# EAGLE design BatchC (EAGLE 6.4)

## Sheet 1 of 5
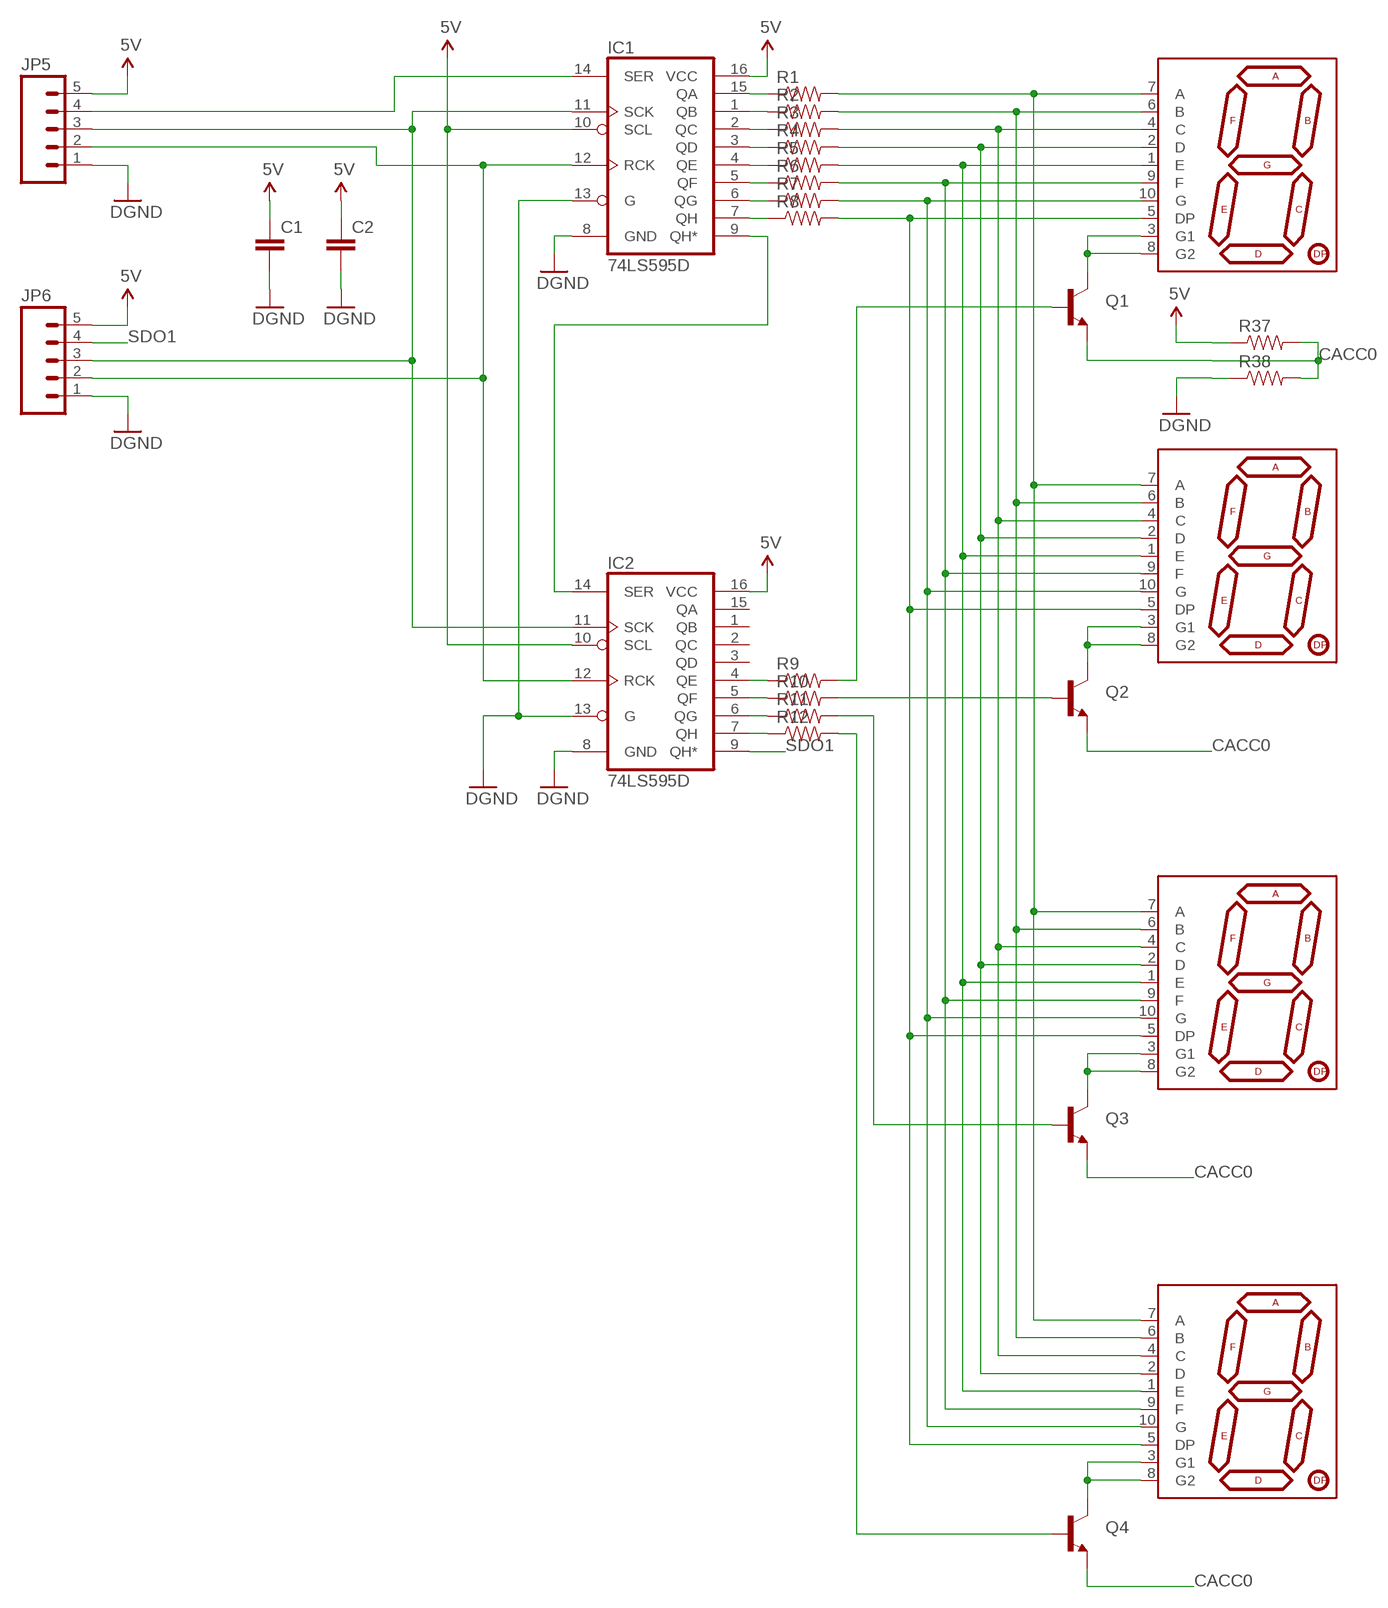
[diagram p0: schematic, sheet 1]

### Parts
C1  CAP1206  [1206]
C2  CAP1206  [1206]
IC1  74LS595D  [SO16]
IC2  74LS595D  [SO16]
JP5  M05PTH  [1X05]
JP6  M05PTH  [1X05]
Q1  TRANSISTOR_NPNSOT23  [SOT23]
Q2  TRANSISTOR_NPNSOT23  [SOT23]
Q3  TRANSISTOR_NPNSOT23  [SOT23]
Q4  TRANSISTOR_NPNSOT23  [SOT23]
R1  RESISTOR0805-RES  [0805]
R2  RESISTOR0805-RES  [0805]
R3  RESISTOR0805-RES  [0805]
R4  RESISTOR0805-RES  [0805]
R5  RESISTOR0805-RES  [0805]
R6  RESISTOR0805-RES  [0805]
R7  RESISTOR0805-RES  [0805]
R8  RESISTOR0805-RES  [0805]
R9  RESISTOR0805-RES  [0805]
R10  RESISTOR0805-RES  [0805]
R11  RESISTOR0805-RES  [0805]
R12  RESISTOR0805-RES  [0805]
R37  RESISTOR0805-RES  [0805]
R38  RESISTOR0805-RES  [0805]
U$1  7-SEGMENT-DISPLAYPTH  [7-SEGMENT-DISPLAY]
U$2  7-SEGMENT-DISPLAYPTH  [7-SEGMENT-DISPLAY]
U$3  7-SEGMENT-DISPLAYPTH  [7-SEGMENT-DISPLAY]
U$4  7-SEGMENT-DISPLAYPTH  [7-SEGMENT-DISPLAY]

### Nets
5V: C1.1 C2.1 IC1.10(SCL) IC1.16(VCC) IC2.10(SCL) IC2.16(VCC) JP5.5 JP6.5 R37.1 ; also sheet 2,3
CACC0: Q1.2(E) Q2.2(E) Q3.2(E) Q4.2(E) R37.2 R38.2
GND: C1.2 C2.2 IC1.8(GND) IC1.13(G) IC2.8(GND) IC2.13(G) JP5.1 JP6.1 R38.1 ; supply symbol labelled DGND ; also sheet 2,3,4
N$1: Q2.3(C) U$1.3(G1) U$1.8(G2)
N$2: Q3.3(C) U$2.3(G1) U$2.8(G2)
N$3: Q4.3(C) U$4.3(G1) U$4.8(G2)
N$4: R4.2 U$1.2(D) U$2.2(D) U$3.2(D) U$4.2(D)
N$5: R5.2 U$1.1(E) U$2.1(E) U$3.1(E) U$4.1(E)
N$6: R6.2 U$1.9(F) U$2.9(F) U$3.9(F) U$4.9(F)
N$7: R7.2 U$1.10(G) U$2.10(G) U$3.10(G) U$4.10(G)
N$8: R8.2 U$1.5(DP) U$2.5(DP) U$3.5(DP) U$4.5(DP)
N$9: IC1.15(QA) R1.1
N$10: IC1.1(QB) R2.1
N$11: IC1.2(QC) R3.1
N$12: IC1.3(QD) R4.1
N$13: IC1.4(QE) R5.1
N$14: IC1.5(QF) R6.1
N$15: IC1.6(QG) R7.1
N$16: IC1.7(QH) R8.1
N$17: Q1.3(C) U$3.3(G1) U$3.8(G2)
N$18: R3.2 U$1.4(C) U$2.4(C) U$3.4(C) U$4.4(C)
N$19: R2.2 U$1.6(B) U$2.6(B) U$3.6(B) U$4.6(B)
N$20: R1.2 U$1.7(A) U$2.7(A) U$3.7(A) U$4.7(A)
N$21: IC2.7(QH) R12.1
N$22: IC2.6(QG) R11.1
N$23: IC2.5(QF) R10.1
N$24: IC2.4(QE) R9.1
N$25: Q3.1(B) R11.2
N$26: Q2.1(B) R10.2
N$27: Q4.1(B) R12.2
N$28: Q1.1(B) R9.2
N$31: IC1.12(RCK) IC2.12(RCK) JP5.2 JP6.2
N$32: IC1.14(SER) JP5.4
N$36: IC1.11(SCK) IC2.11(SCK) JP5.3 JP6.3
N$37: IC1.9(QH*) IC2.14(SER)
SDO1: IC2.9(QH*) JP6.4
Unconnected: IC2.1(QB) IC2.2(QC) IC2.3(QD) IC2.15(QA)

## Sheet 2 of 5
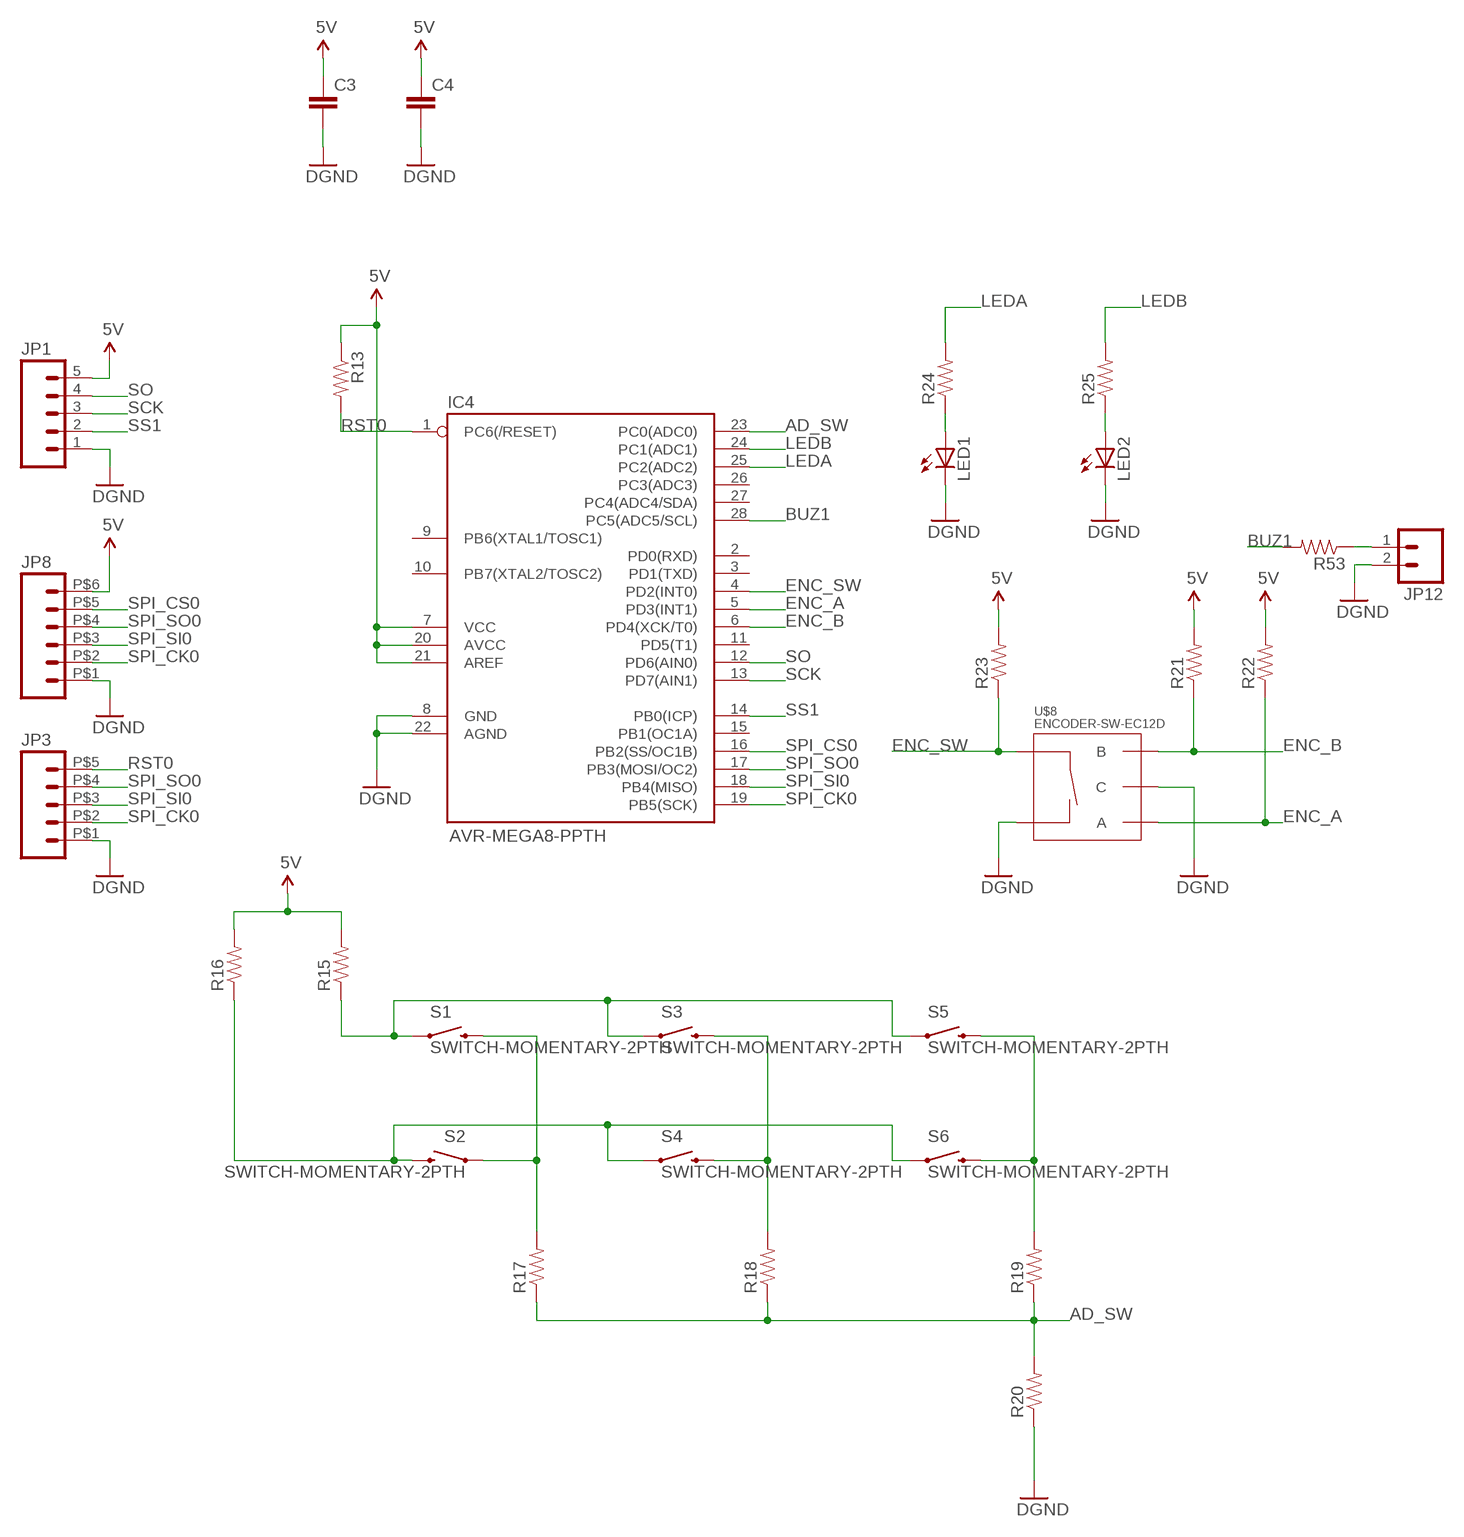
[diagram p1: schematic, sheet 2]

### Parts
C3  CAP1206  [1206]
C4  CAP1206  [1206]
IC4  AVR-MEGA8-PPTH  [DIL28-3]
JP1  M05PTH  [1X05]
JP3  M05  [1X05_SMALLPADS]
JP8  M06  [1X06_SMALLPADS]
JP12  M02PTH  [1X02]
LED1  LED3MM  [LED3MM]
LED2  LED3MM  [LED3MM]
R13  RESISTOR0805-RES  [0805]
R15  RESISTOR0805-RES  [0805]
R16  RESISTOR0805-RES  [0805]
R17  RESISTOR0805-RES  [0805]
R18  RESISTOR0805-RES  [0805]
R19  RESISTOR0805-RES  [0805]
R20  RESISTOR0805-RES  [0805]
R21  RESISTOR0805-RES  [0805]
R22  RESISTOR0805-RES  [0805]
R23  RESISTOR0805-RES  [0805]
R24  RESISTOR0805-RES  [0805]
R25  RESISTOR0805-RES  [0805]
R53  RESISTOR0805-RES  [0805]
S1  SWITCH-MOMENTARY-2PTH  [TACTILE-PTH]
S2  SWITCH-MOMENTARY-2PTH  [TACTILE-PTH]
S3  SWITCH-MOMENTARY-2PTH  [TACTILE-PTH]
S4  SWITCH-MOMENTARY-2PTH  [TACTILE-PTH]
S5  SWITCH-MOMENTARY-2PTH  [TACTILE-PTH]
S6  SWITCH-MOMENTARY-2PTH  [TACTILE-PTH]
U$8  ENCODER-SW-EC12D  [ENCODER-SW-EC12D]

### Nets
5V: C3.1 C4.1 IC4.7(VCC) IC4.20(AVCC) IC4.21(AREF) JP1.5 JP8.P$6 R13.1 R15.2 R16.2 R21.2 R22.2 R23.2 ; also sheet 1,3
AD_SW: IC4.23(PC0(ADC0)) R17.1 R18.1 R19.1 R20.2
BUZ1: IC4.28(PC5(ADC5/SCL)) R53.2
ENC_A: IC4.5(PD3(INT1)) R22.1 U$8.1(A)
ENC_B: IC4.6(PD4(XCK/T0)) R21.1 U$8.3(B)
ENC_SW: IC4.4(PD2(INT0)) R23.1 U$8.2(SW+)
GND: C3.2 C4.2 IC4.8(GND) IC4.22(AGND) JP1.1 JP3.P$1 JP8.P$1 JP12.2 LED1.K(C) LED2.K(C) R20.1 U$8.4(C) U$8.5(SW-) ; supply symbol labelled DGND ; also sheet 1,3,4
LEDA: IC4.25(PC2(ADC2)) R24.2
LEDB: IC4.24(PC1(ADC1)) R25.2
N$34: R17.2 S1.3 S2.1
N$35: R16.1 S2.3 S4.1 S6.1
N$40: R15.1 S1.1 S3.1 S5.1
N$41: R18.2 S3.3 S4.3
N$42: R19.2 S5.3 S6.3
N$44: LED1.A R24.1
N$50: LED2.A R25.1
N$68: JP12.1 R53.1
RST0: IC4.1(PC6(/RESET)) JP3.P$5 R13.2
SCK: IC4.13(PD7(AIN1)) JP1.3
SO: IC4.12(PD6(AIN0)) JP1.4
SPI_CK0: IC4.19(PB5(SCK)) JP3.P$2 JP8.P$2
SPI_CS0: IC4.16(PB2(SS/OC1B)) JP8.P$5
SPI_SI0: IC4.18(PB4(MISO)) JP3.P$3 JP8.P$3
SPI_SO0: IC4.17(PB3(MOSI/OC2)) JP3.P$4 JP8.P$4
SS1: IC4.14(PB0(ICP)) JP1.2
Unconnected: IC4.2(PD0(RXD)) IC4.3(PD1(TXD)) IC4.9(PB6(XTAL1/TOSC1)) IC4.10(PB7(XTAL2/TOSC2)) IC4.11(PD5(T1)) IC4.15(PB1(OC1A)) IC4.26(PC3(ADC3)) IC4.27(PC4(ADC4/SDA))

## Sheet 3 of 5
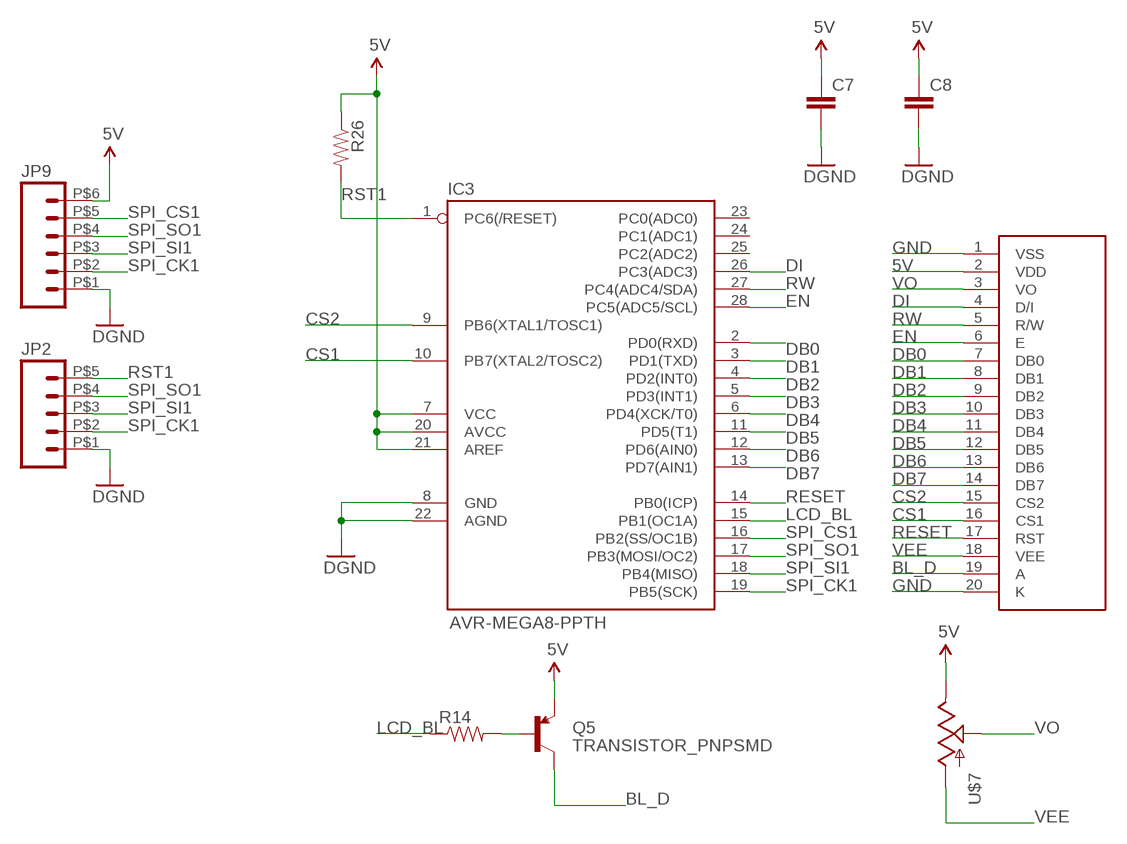
[diagram p2: schematic, sheet 3]

### Parts
C7  CAP1206  [1206]
C8  CAP1206  [1206]
IC3  AVR-MEGA8-PPTH  [DIL28-3]
JP2  M05  [1X05_SMALLPADS]
JP9  M06  [1X06_SMALLPADS]
Q5  TRANSISTOR_PNPSMD  [SOT23-3]
R14  RESISTOR0805-RES  [0805]
R26  RESISTOR0805-RES  [0805]
U$7  POTTRIM  [TRIM_POT]
U$9  LCD-G12864BARE  [1X20]

### Nets
5V: C7.1 C8.1 IC3.7(VCC) IC3.20(AVCC) IC3.21(AREF) JP9.P$6 Q5.2(E) R26.1 U$7.2(E) U$9.2(VDD) ; also sheet 1,2
BL_D: Q5.3(C) U$9.19(A)
CS1: IC3.10(PB7(XTAL2/TOSC2)) U$9.16(CS1)
CS2: IC3.9(PB6(XTAL1/TOSC1)) U$9.15(CS2)
DB0: IC3.2(PD0(RXD)) U$9.7(DB0)
DB1: IC3.3(PD1(TXD)) U$9.8(DB1)
DB2: IC3.4(PD2(INT0)) U$9.9(DB2)
DB3: IC3.5(PD3(INT1)) U$9.10(DB3)
DB4: IC3.6(PD4(XCK/T0)) U$9.11(DB4)
DB5: IC3.11(PD5(T1)) U$9.12(DB5)
DB6: IC3.12(PD6(AIN0)) U$9.13(DB6)
DB7: IC3.13(PD7(AIN1)) U$9.14(DB7)
DI: IC3.26(PC3(ADC3)) U$9.4(D/I)
EN: IC3.28(PC5(ADC5/SCL)) U$9.6(E)
GND: C7.2 C8.2 IC3.8(GND) IC3.22(AGND) JP2.P$1 JP9.P$1 U$9.1(VSS) U$9.20(K) ; supply symbol labelled DGND ; also sheet 1,2,4
LCD_BL: IC3.15(PB1(OC1A)) R14.1
N$33: Q5.1(B) R14.2
RESET: IC3.14(PB0(ICP)) U$9.17(RST)
RST1: IC3.1(PC6(/RESET)) JP2.P$5 R26.2
RW: IC3.27(PC4(ADC4/SDA)) U$9.5(R/W)
SPI_CK1: IC3.19(PB5(SCK)) JP2.P$2 JP9.P$2
SPI_CS1: IC3.16(PB2(SS/OC1B)) JP9.P$5
SPI_SI1: IC3.18(PB4(MISO)) JP2.P$3 JP9.P$3
SPI_SO1: IC3.17(PB3(MOSI/OC2)) JP2.P$4 JP9.P$4
VEE: U$7.3(A) U$9.18(VEE)
VO: U$7.1(S) U$9.3(VO)
Unconnected: IC3.23(PC0(ADC0)) IC3.24(PC1(ADC1)) IC3.25(PC2(ADC2))

## Sheet 4 of 5
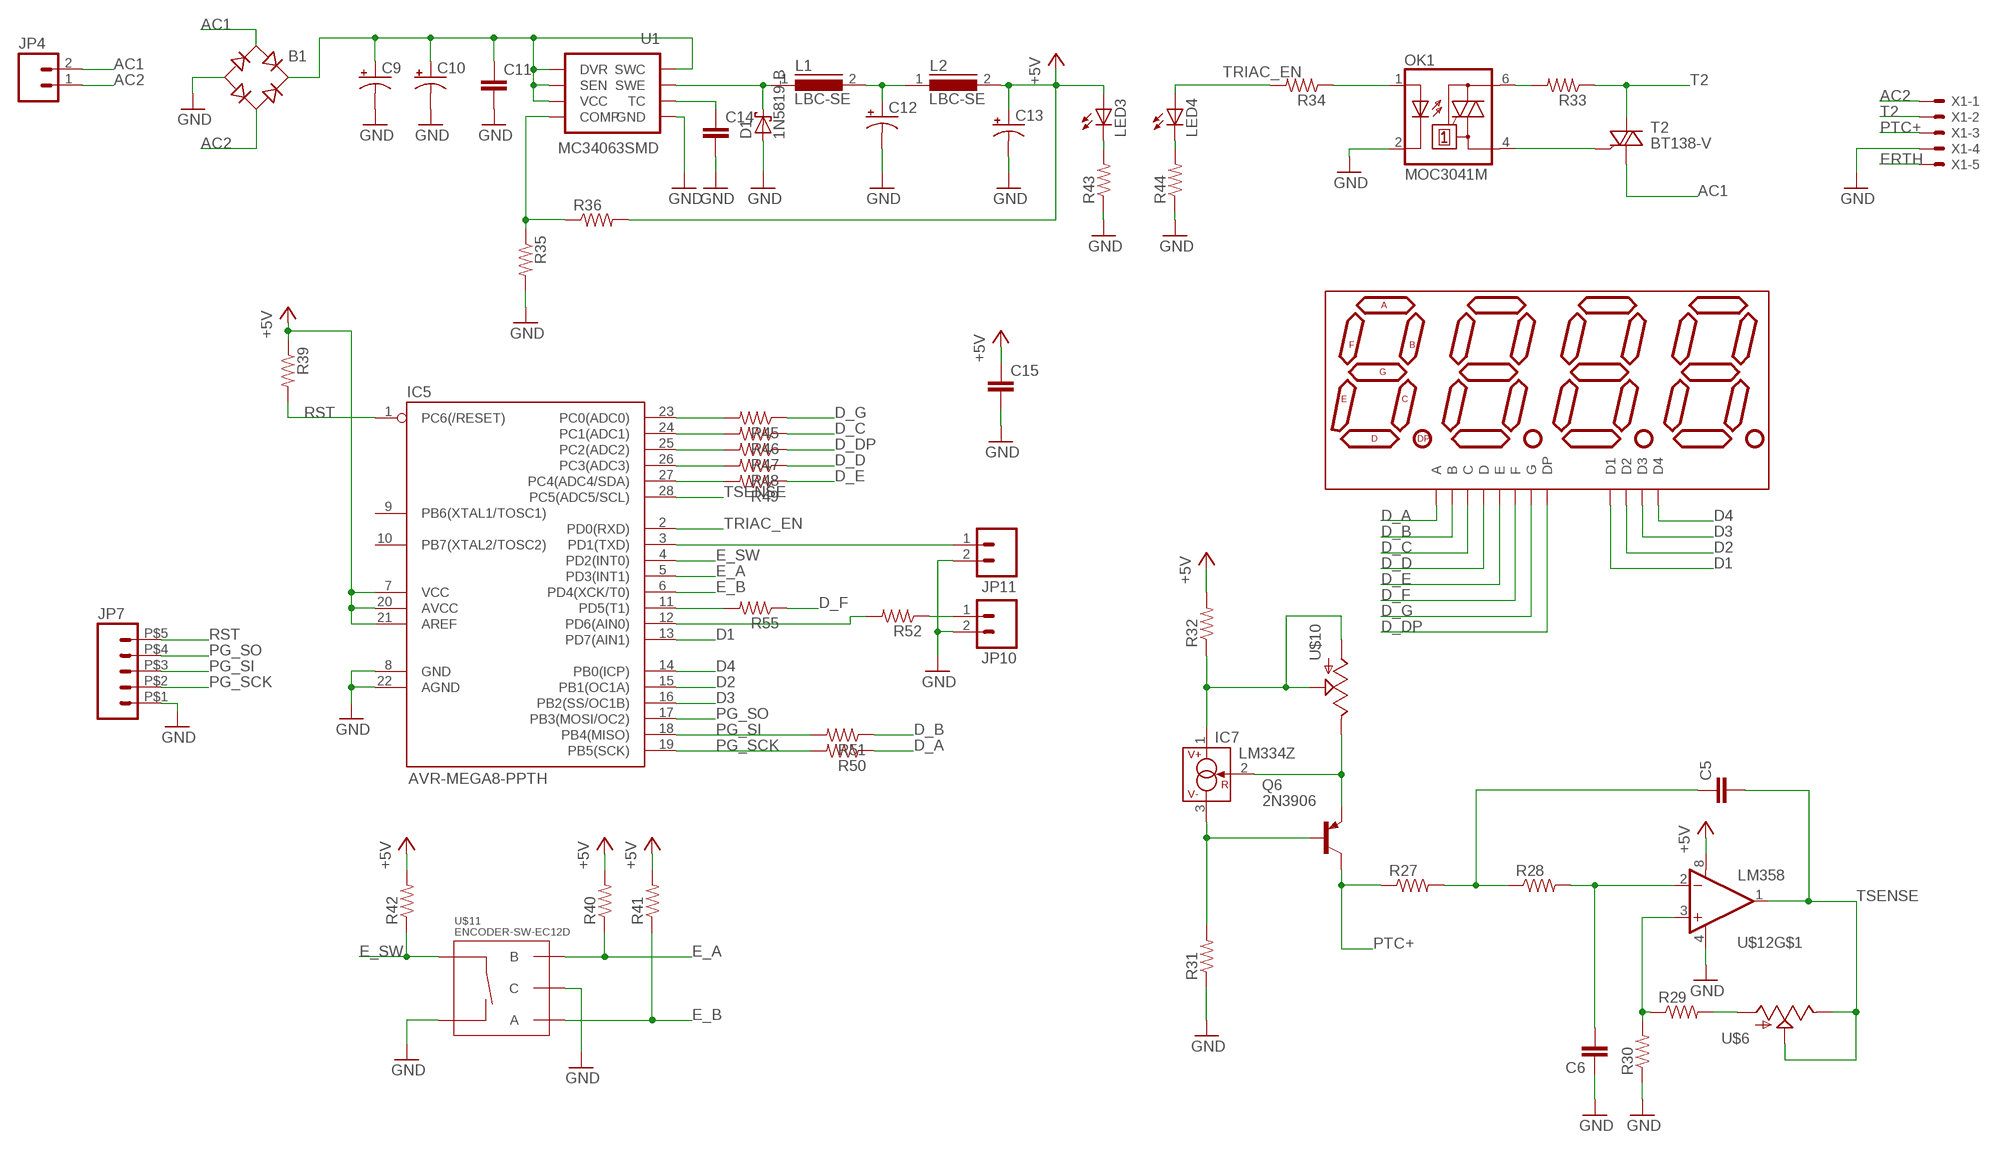
[diagram p3: schematic, sheet 4]

### Parts
B1  RB1A  [RB1A]
C5  CAPPTH  [CAP-PTH-SMALL]
C6  CAPPTH  [CAP-PTH-SMALL]
C9  CAP_POLPTH1  [CPOL-RADIAL-100UF-25V]
C10  CAP_POLPTH1  [CPOL-RADIAL-100UF-25V]
C11  CAP1206  [1206]
C12  CAP_POLPTH1  [CPOL-RADIAL-100UF-25V]
C13  CAP_POLPTH1  [CPOL-RADIAL-100UF-25V]
C14  CAP1206  [1206]
C15  CAP1206  [1206]
D1  1N5819-B  [DO41-7.6]
IC5  AVR-MEGA8-PPTH  [DIL28-3]
IC7  LM334Z  [TO92]
JP4  M023.5MM  [SCREWTERMINAL-3.5MM-2]
JP7  M05  [1X05_SMALLPADS]
JP10  M02PTH  [1X02]
JP11  M02PTH  [1X02]
L1  LBC-SE  [LBC-SE]
L2  LBC-SE  [LBC-SE]
LED3  LED3MM  [LED3MM]
LED4  LED3MM  [LED3MM]
OK1  MOC3041M  [DIL06]
Q6  2N3906  [TO92]
R27  RESISTOR0603-RES  [0603-RES]
R28  RESISTOR0603-RES  [0603-RES]
R29  RESISTOR0603-RES  [0603-RES]
R30  RESISTOR0603-RES  [0603-RES]
R31  RESISTOR0603-RES  [0603-RES]
R32  RESISTOR0603-RES  [0603-RES]
R33  RESISTOR0603-RES  [0603-RES]
R34  RESISTOR0603-RES  [0603-RES]
R35  RESISTOR0603-RES  [0603-RES]
R36  RESISTOR0603-RES  [0603-RES]
R39  RESISTOR0603-RES  [0603-RES]
R40  RESISTOR0603-RES  [0603-RES]
R41  RESISTOR0603-RES  [0603-RES]
R42  RESISTOR0603-RES  [0603-RES]
R43  RESISTOR0603-RES  [0603-RES]
R44  RESISTOR0603-RES  [0603-RES]
R45  RESISTOR0603-RES  [0603-RES]
R46  RESISTOR0603-RES  [0603-RES]
R47  RESISTOR0603-RES  [0603-RES]
R48  RESISTOR0603-RES  [0603-RES]
R49  RESISTOR0603-RES  [0603-RES]
R50  RESISTOR0603-RES  [0603-RES]
R51  RESISTOR0603-RES  [0603-RES]
R52  RESISTOR0603-RES  [0603-RES]
R55  RESISTOR0603-RES  [0603-RES]
T2  BT138-V  [TO220BV]
U1  MC34063SMD  [SO08]
U$5  7-SEGMENT-4DIGIT-COUNTER  [7-SEGMENT-4DIGIT-TPS]
U$6  POTTRIM  [TRIM_POT]
U$10  POTTRIM  [TRIM_POT]
U$11  ENCODER-SW-EC12D  [ENCODER-SW-EC12D]
U$12  LM358  [DIP08]
X1  KK-156-5  [KK-156-5]

### Nets
+5V: C13.1(+) C15.1 IC5.7(VCC) IC5.20(AVCC) IC5.21(AREF) L2.2 LED3.A R32.2 R36.2 R39.1 R40.2 R41.2 R42.2 U$12.8(V+)
AC1: B1.AC1 JP4.2 T2.T1(A1)
AC2: B1.AC2 JP4.1 X1.1
D1: IC5.13(PD7(AIN1)) U$5.P$12(D1)
D2: IC5.15(PB1(OC1A)) U$5.P$9(D2)
D3: IC5.16(PB2(SS/OC1B)) U$5.P$8(D3)
D4: IC5.14(PB0(ICP)) U$5.P$6(D4)
D_A: R50.1 U$5.P$11(A)
D_B: R51.1 U$5.P$7(B)
D_C: R46.1 U$5.P$4(C)
D_D: R48.1 U$5.P$2(D)
D_DP: R47.1 U$5.P$3(DP)
D_E: R49.1 U$5.P$1(E)
D_F: R55.1 U$5.P$10(F)
D_G: R45.1 U$5.P$5(G)
E_A: IC5.5(PD3(INT1)) R40.1 U$11.3(B)
E_B: IC5.6(PD4(XCK/T0)) R41.1 U$11.1(A)
E_SW: IC5.4(PD2(INT0)) R42.1 U$11.2(SW+)
ERTH: X1.5
GND: B1.- C6.1 C9.2(-) C10.2(-) C11.2 C12.2(-) C13.2(-) C14.2 C15.2 D1.A IC5.8(GND) IC5.22(AGND) JP7.P$1 JP10.2 JP11.2 OK1.2(C) R30.1 R31.1 R35.2 R43.1 R44.1 U1.4(GND) U$11.4(C) U$11.5(SW-) U$12.4(V-) X1.4 ; also sheet 1,2,3
N$38: IC7.3(V-) Q6.2(B) R31.2
N$39: IC7.1(V+) R32.1 U$10.1(S) U$10.3(A)
N$43: IC5.24(PC1(ADC1)) R46.2
N$45: IC7.2(R) Q6.3(E) U$10.2(E)
N$46: OK1.1(A) R34.1
N$47: OK1.6(A2) R33.2
N$48: C5.1 R27.2 R28.1
N$49: C6.2 R28.2 U$12.2(-IN)
N$51: IC5.25(PC2(ADC2)) R47.2
N$52: R29.2 U$6.3(A)
N$53: LED3.K(C) R43.2
N$54: R29.1 R30.2 U$12.3(+IN)
N$55: OK1.4(A1) T2.G
N$56: LED4.K(C) R44.2
N$57: B1.+ C9.1(+) C10.1(+) C11.1 U1.1(SWC) U1.6(VCC) U1.7(SEN) U1.8(DVR)
N$58: C14.1 U1.3(TC)
N$59: D1.C L1.1 U1.2(SWE)
N$60: C12.1(+) L1.2 L2.1
N$61: R35.1 R36.1 U1.5(COMP)
N$62: IC5.26(PC3(ADC3)) R48.2
N$63: IC5.27(PC4(ADC4/SDA)) R49.2
N$64: IC5.23(PC0(ADC0)) R45.2
N$65: IC5.11(PD5(T1)) R55.2
N$66: IC5.12(PD6(AIN0)) R52.2
N$69: JP10.1 R52.1
N$72: IC5.3(PD1(TXD)) JP11.1
PG_SCK: IC5.19(PB5(SCK)) JP7.P$2 R50.2
PG_SI: IC5.18(PB4(MISO)) JP7.P$3 R51.2
PG_SO: IC5.17(PB3(MOSI/OC2)) JP7.P$4
PTC+: Q6.1(C) R27.1 X1.3
RST: IC5.1(PC6(/RESET)) JP7.P$5 R39.2
T2: R33.1 T2.T2(A2) X1.2
TRIAC_EN: IC5.2(PD0(RXD)) LED4.A R34.2
TSENSE: C5.2 IC5.28(PC5(ADC5/SCL)) U$6.1(S) U$6.2(E) U$12.1(OUT)
Unconnected: IC5.9(PB6(XTAL1/TOSC1)) IC5.10(PB7(XTAL2/TOSC2)) U$12.5(+IN) U$12.6(-IN) U$12.7(OUT)

## Sheet 5 of 5
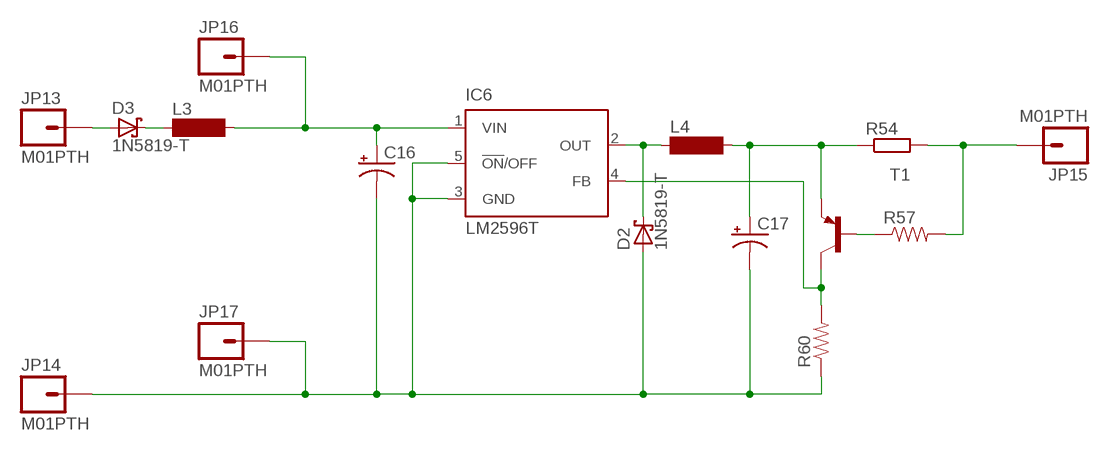
[diagram p4: schematic, sheet 5]

### Parts
C16  CAP_POLPTH1  [CPOL-RADIAL-100UF-25V]
C17  CAP_POLPTH1  [CPOL-RADIAL-100UF-25V]
D2  1N5819-T  [DO41-7.6]
D3  1N5819-T  [DO41-7.6]
IC6  LM2596T  [T05D]
JP13  M01PTH  [1X01]
JP14  M01PTH  [1X01]
JP15  M01PTH  [1X01]
JP16  M01PTH  [1X01]
JP17  M01PTH  [1X01]
L3  BS11  [BS11]
L4  BS11  [BS11]
R54  R-EU_0204/2V  [0204V]
R57  RESISTOR1206  [1206]
R60  RESISTOR1206  [1206]
T1  BC857C-PNP-SOT23-BEC  [SOT23-BEC]

### Nets
N$70: D3.A JP13.1
N$71: D3.C L3.1
N$73: C16.1(+) IC6.1(VIN) JP16.1 L3.2
N$74: C16.2(-) C17.2(-) D2.A IC6.3(GND) IC6.5(!ON!/OFF) JP14.1 JP17.1 R60.1
N$75: D2.C IC6.2(OUT) L4.1
N$76: C17.1(+) L4.2 R54.1 T1.E
N$77: IC6.4(FB) R60.2 T1.C
N$80: R57.1 T1.B
N$81: JP15.1 R54.2 R57.2

## Library data of the parts
B1 = rectifier:RB1A: RECTIFIER 1 A
C1-C8 C11 C14 C15 = SparkFun-Capacitors:CAP: Capacitor Standard 0603 ceramic capacitor, and 0.1" leaded capacitor.
C9 C10 C12 C13 = SparkFun-Capacitors:CAP_POL: Capacitor Polarized These are standard SMD and PTH capacitors. Normally 10uF, 47uF, and 100uF in electrolytic and tantalum varieties. Always verify the external diameter of the through hole cap, it varies with capacity, voltage, and manufacturer. The EIA devices should be standard.
C16 C17 = SparkFun-Passives:CAP_POL: Capacitor Polarized These are standard SMD and PTH capacitors. Normally 10uF, 47uF, and 100uF in electrolytic and tantalum varieties. Always verify the external diameter of the through hole cap, it varies with capacity, voltage, and manufacturer. The EIA devices should be standard.
D1-D3 = diode:1N581*: 1.0A SCHOTTKY BARRIER RECTIFIER Source: http://www.diodes.com/datasheets/ds23001.pdf
IC1 IC2 = SparkFun-DigitalIC:74*595: 8-bit SHIFT REGISTER, output latch
IC3-IC5 = SparkFun-DigitalIC:AVR-MEGA8-P: MICROCONTROLLER 8 Kbytes FLASH 1 kbytes SRAM 512 bytes EEPROM USART 4-channel 10 bit ADC 2-channel 8 bit ADC
IC6 = national-semiconductor:LM2596: SIMPLE SWITCHER® Power Converter 150 kHz 3A Step-Down Voltage Regulator Source: http://www.national.com/ds/LM/LM2596.pdf; MPN: LM2596T-ADJ/LF02; OC_FARNELL: 9494162; OC_NEWARK: 65K5910
IC7 = linear:LM*34: 3-Terminal Adjustable Current Sources Source: www.national.com/pf/LM/LM334.html | LM134.pdf
JP1-JP3 JP5-JP7 = SparkFun-Connectors:M05: Header 5 Standard 5-pin 0.1" header. Use with straight break away headers (SKU : PRT-00116), right angle break away headers (PRT-00553), swiss pins (PRT-00743), machine pins (PRT-00117), and female headers (PRT-00115). Molex polarized connector foot print use with SKU : PRT-08230 with associated crimp pins and housings.
JP4 JP10-JP12 = SparkFun-Connectors:M02: Header 2 Standard 2-pin 0.1" header. Use with straight break away headers (SKU : PRT-00116), right angle break away headers (PRT-00553), swiss pins (PRT-00743), machine pins (PRT-00117), and female headers (PRT-00115). Molex polarized connector foot print use with SKU : PRT-08233 with associated crimp pins and housings.
JP8 JP9 = SparkFun-Connectors:M06: Header 6 Standard 6-pin 0.1" header. Use with straight break away headers (SKU : PRT-00116), right angle break away headers (PRT-00553), swiss pins (PRT-00743), machine pins (PRT-00117), and female headers (PRT-00115). Molex polarized connector foot print use with SKU : PRT-08094 with associated crimp pins and housings. NOTES ON THE VARIANTS LOCK and LOCK_LONGPADS... This footprint was designed to help hold the alignment of a through-hole component (i.e. 6-pin header) while soldering it into place. You may notice that each hole has been shifted either up or down by 0.005 of an inch from it's more standard position (which is a perfectly straight line). This slight alteration caused the pins (the squares in the middle) to touch the edges of the holes. Because they are alternating, it causes a "brace" to hold the component in place. 0.005 has proven to be the perfect amount of "off-center" position when using our standard breakaway headers. Although looks a little odd when you look at the bare footprint, once you have a header in there, the alteration is very hard to notice. Also, if you push a header all the way into place, it is covered up entirely on the bottom side. This idea of altering the position of holes to aid alignment will be further integrated into the Sparkfun Library for other footprints. It can help hold any component with 3 or more connection pins.
JP13-JP17 = SparkFun-Connectors:M01: Header 1 Standard 1-pin 0.1" header. Use with straight break away headers (SKU : PRT-00116), right angle break away headers (PRT-00553), swiss pins (PRT-00743), machine pins (PRT-00117), and female headers (PRT-00115).
L1 L2 = inductors:LBC-SE: INDUCTOR
L3 L4 = inductor-neosid:BS: INDUCTOR nominal inductance, magnetically screened; OC_FARNELL: unknown; OC_NEWARK: unknown
LED1-LED4 = SparkFun-LED:LED: LEDs Standard schematic elements and footprints for 5mm, 3mm, 1206, and 0603 sized LEDs. 5mm - Spark Fun Electronics SKU : COM-00529 (and others)
OK1 = optocoupler:MOC30*: 6-Pin DIP Zero-Cross Optoisolators Triac Driver Output (250/400 Volt Peak) Source: http://www.fairchildsemi.com/ds/MO/MOC3043-M.pdf; MF: FAIRCHILD SEMICONDUCTOR; MPN: MOC3041M; OC_FARNELL: 1086677; OC_NEWARK: 78K6090
Q1-Q4 = SparkFun-DiscreteSemi:TRANSISTOR_NPN: Generic NPN BJT. MMBT2222 is the common NPN we use. Double check against datasheet- not all devices are the same!
Q5 = SparkFun-DiscreteSemi:TRANSISTOR_PNP: Generic PNP BJT. Double check pinouts against datasheets- not all devices are the same!
Q6 = transistor-pnp:2N3906: PNP Transistor
R1-R26 R37 R38 R53 = SparkFun-Passives:RESISTOR: Resistor Basic schematic elements and footprints for 0603, 1206, and PTH resistors.
R27-R36 R39-R52 R55 R57 R60 = SparkFun-Resistors:RESISTOR: Resistor Basic schematic elements and footprints for 0603, 1206, and PTH resistors.
R54 = rcl:R-EU_: RESISTOR, European symbol
S1-S6 = SparkFun-Electromechanical:SWITCH-MOMENTARY-2: Various NO switches- pushbuttons, reed, etc
T1 = transistor-neu-to92:*-PNP-: PNP Transistror
T2 = triac:BT138: TRIAC Source: http://www.semiconductors.philips.com BT138_SERIES_2.pdf
U1 = SparkFun-PowerIC:MC34063: Jellybean switching supply controller
U$1-U$4 = SparkFun-Displays:7-SEGMENT-DISPLAY
U$5 = SparkFun-Displays:7-SEGMENT-4DIGIT-COUNTER
U$6 U$7 U$10 = SparkFun-Electromechanical:POT
U$8 U$11 = SparkFun-Electromechanical:ENCODER-SW-EC12D
U$9 = SparkFun-Displays:LCD-G12864: Graphical LCD 128x64 Footprint is not yet proven. Double check it. Spark Fun Electronics SKU : LCD-00710
U$12 = SparkFun-AnalogIC:LM358: Jellybean op-amp
X1 = con-molex:KK-156-5: KK 156 HEADER Source: http://www.molex.com/pdm_docs/sd/026604100_sd.pdf; OC_FARNELL: unknown; OC_NEWARK: unknown

## Board
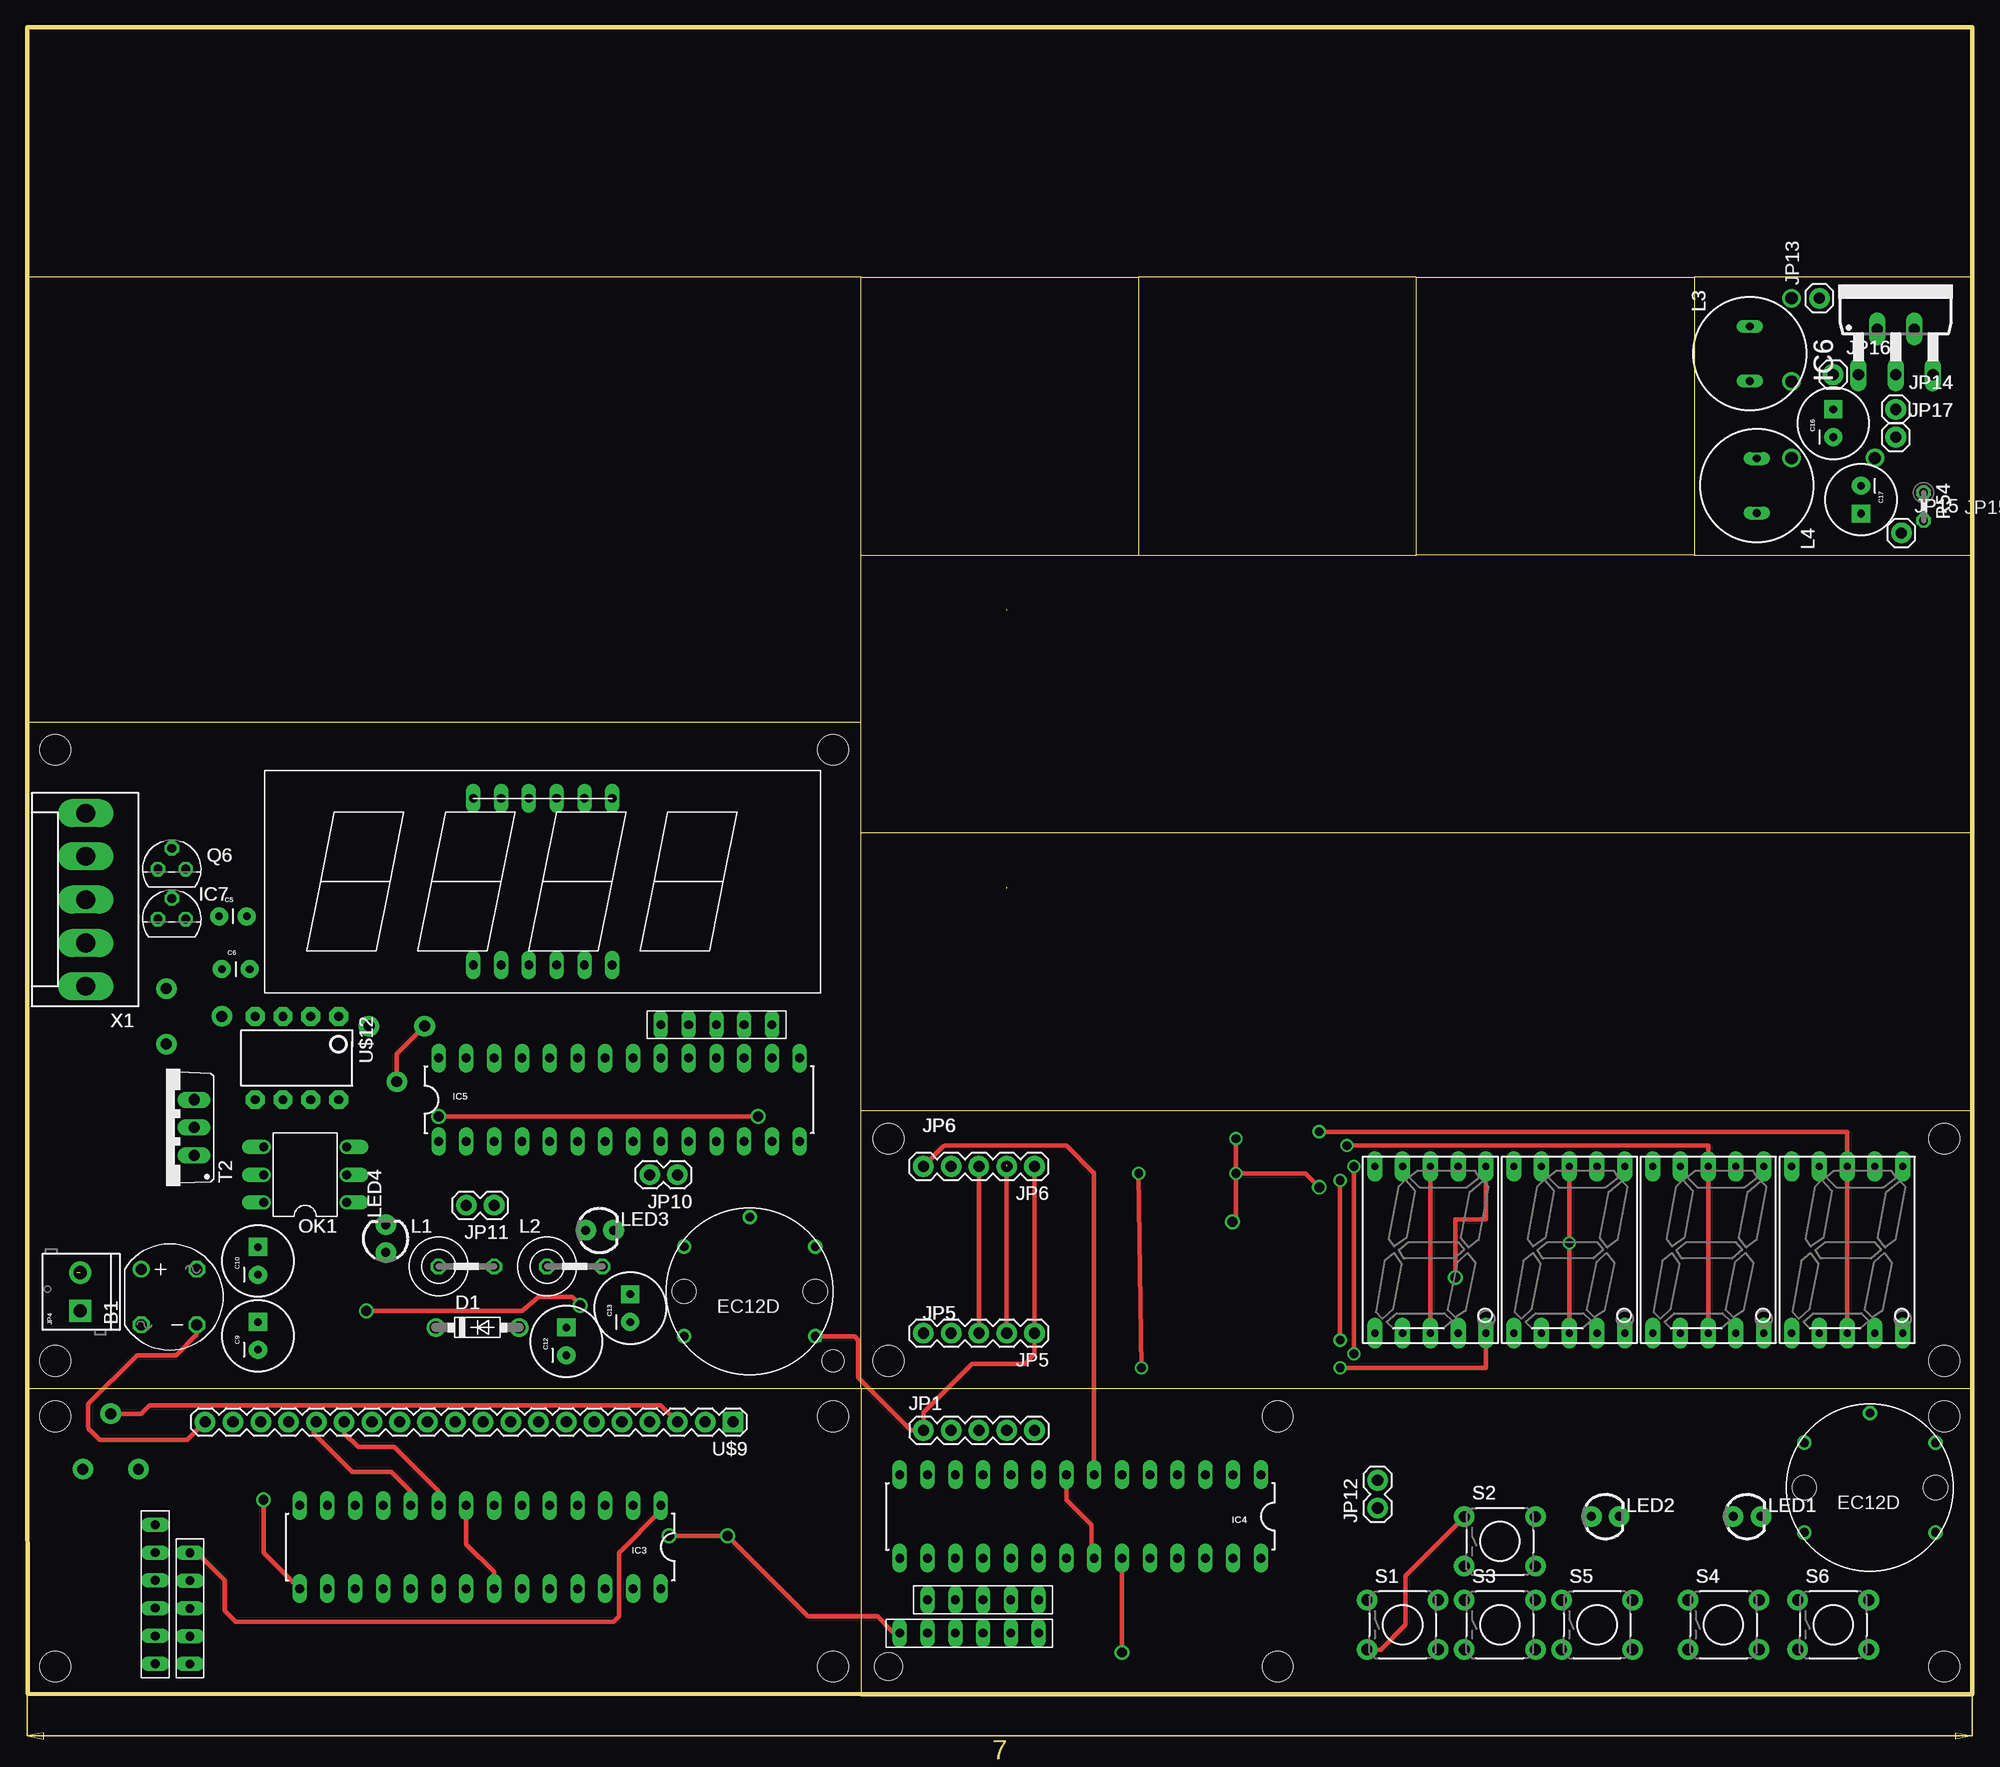
[diagram p5: board, top side]
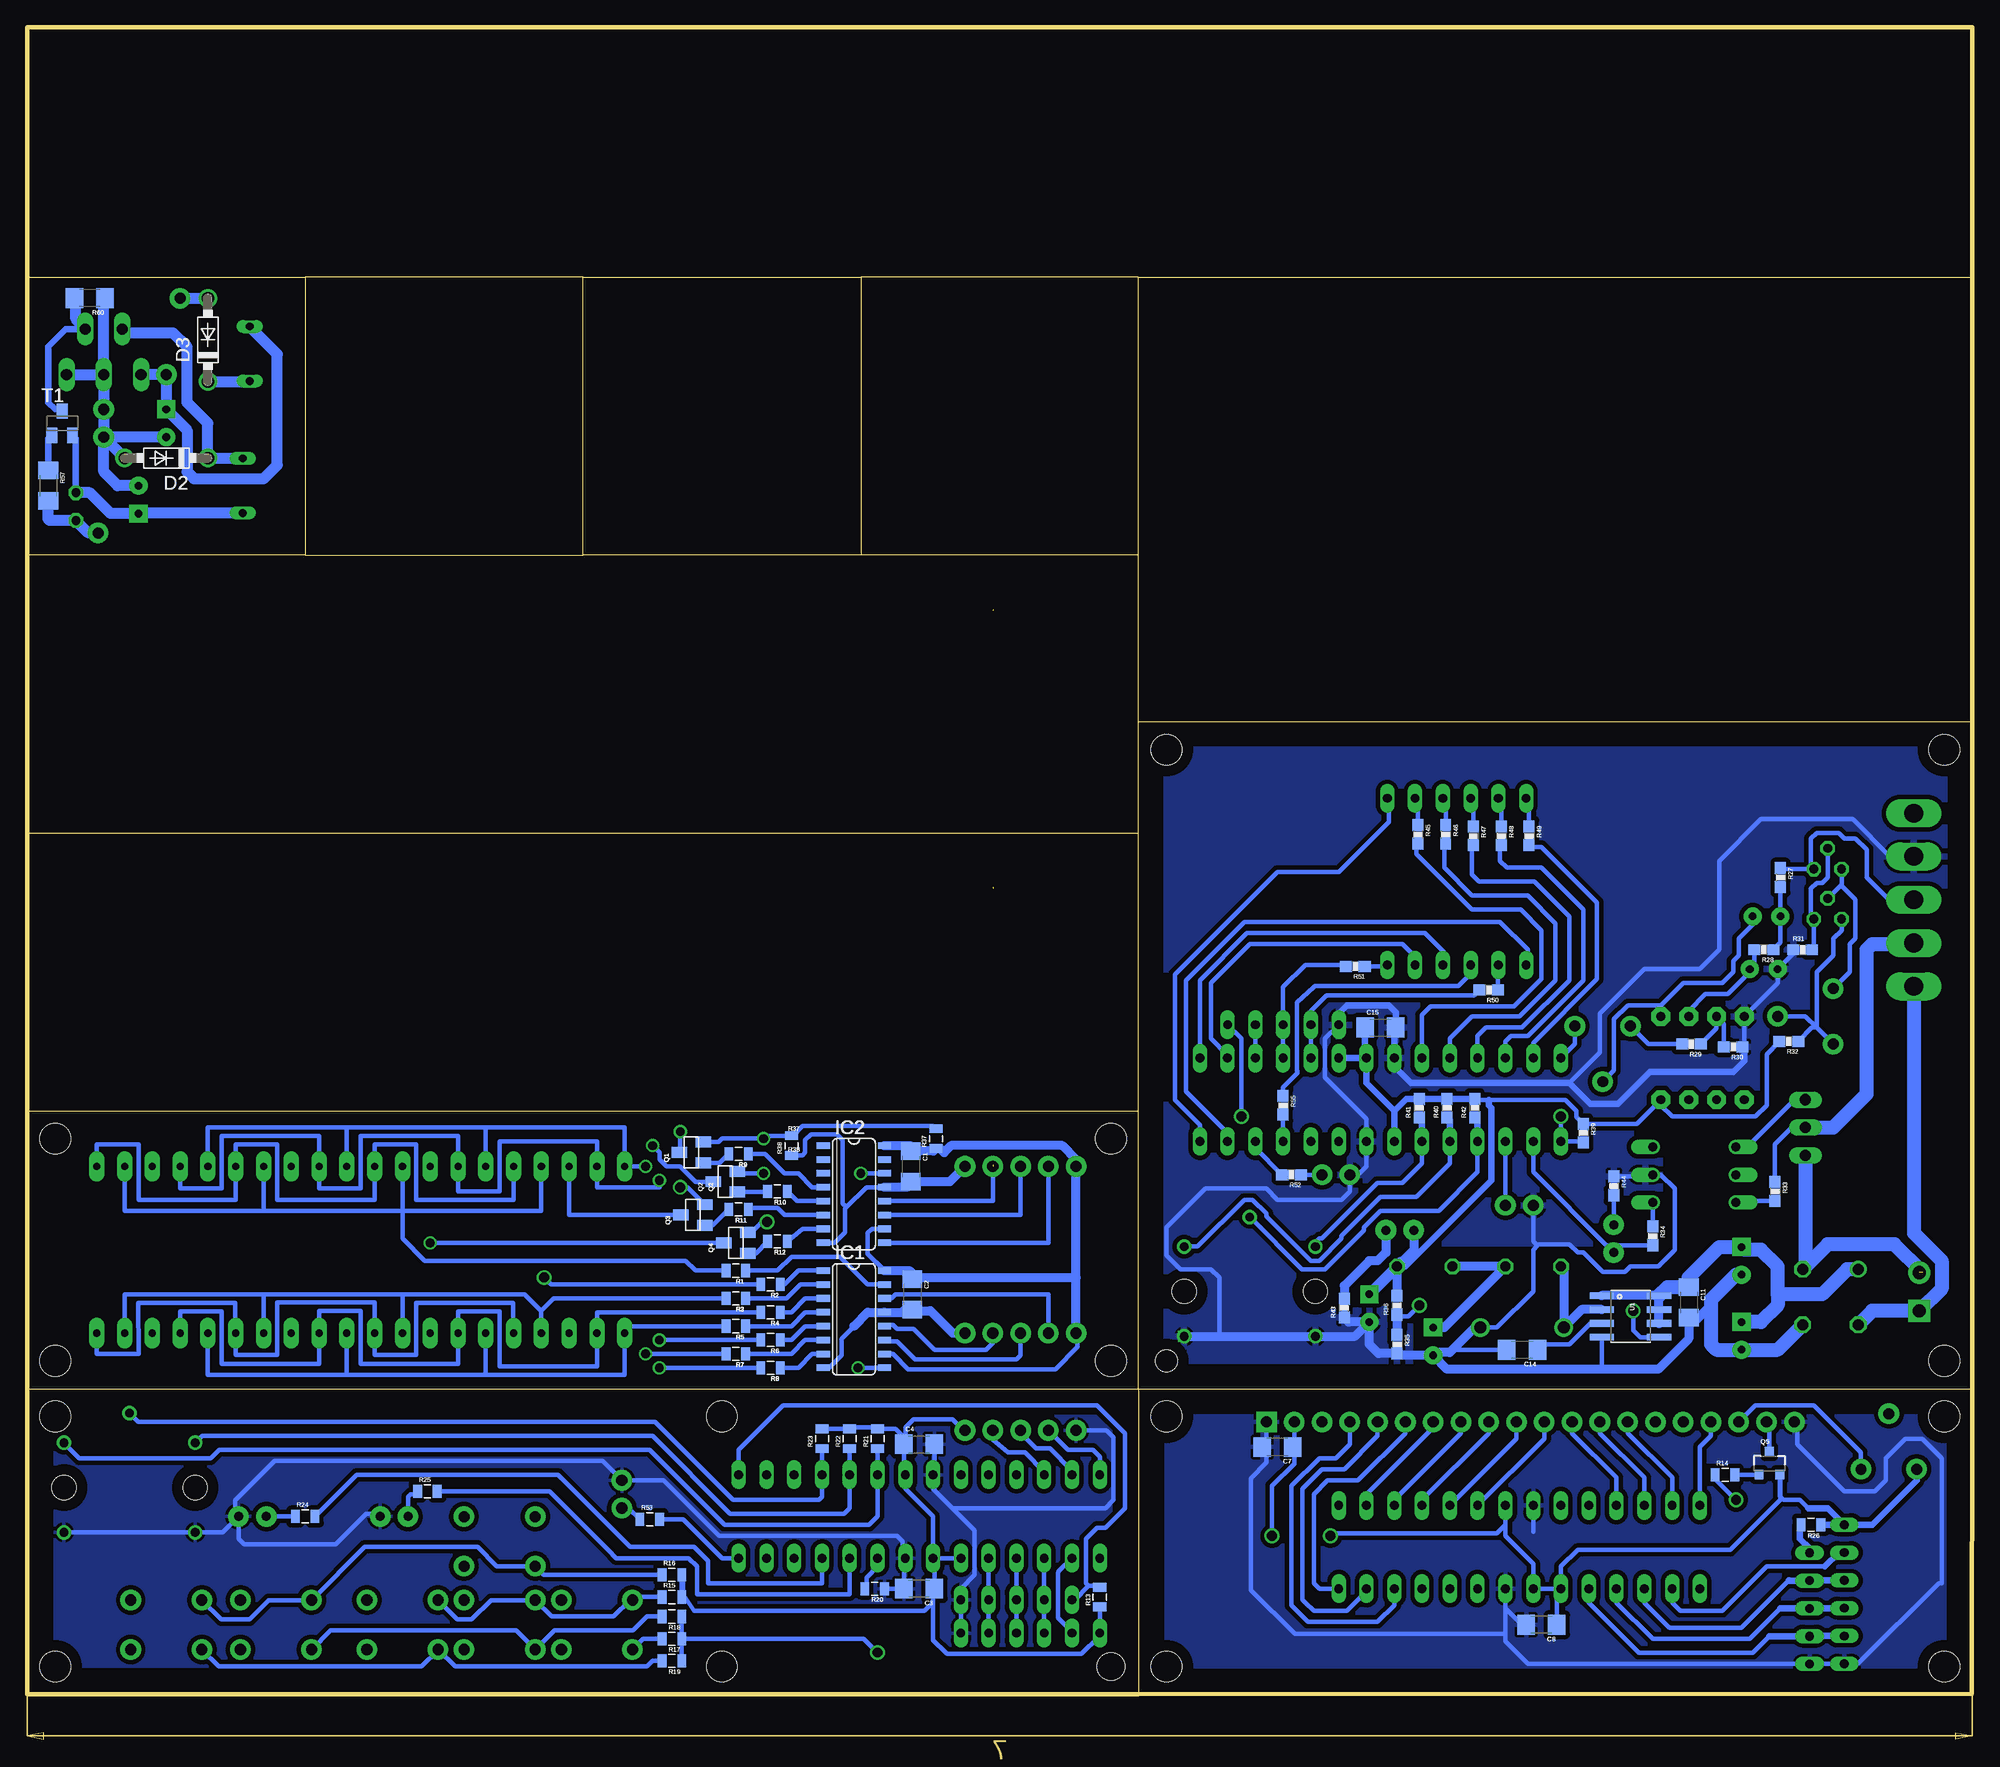
[diagram p6: board, bottom side, seen from below]

Size 177.8 x 152.4 mm. Coordinates in mm from the lower left corner, seen from the top.
Outline: 177.8,53.34 177.8,27.94 76.2,27.94
Outline: 76.2,27.94 76.2,53.34
Outline: 177.8,129.54 177.8,152.4 0,152.4 0,129.54
Outline: 177.8,129.54 177.8,104.14
Outline: 177.8,104.14 177.8,78.74
Outline: 177.8,78.74 177.8,53.34
Outline: 177.8,53.34 177.8,0 76.2,0
Outline: 76.2,0 0.05,0.05 0,27.94
Outline: 0,27.94 0,88.9
Outline: 0,88.9 0,129.54
Outline: 76.2,53.34 76.2,78.74
Outline: 177.8,53.34 76.2,53.34
Outline: 76.2,78.74 76.2,88.9
Outline: 76.2,88.9 76.2,104.14
Outline: 76.2,104.14 101.6,104.14
Outline: 101.6,104.14 127,104.14
Outline: 152.4,104.14 177.8,104.14
Outline: 177.8,78.74 76.2,78.74
Outline: 76.2,27.94 76.2,0
Outline: 76.2,27.94 0,27.94
Outline: 0,88.9 76.2,88.9
Outline: 76.2,104.14 76.2,129.54
Outline: 76.2,129.54 101.6,129.54
Outline: 127,129.54 152.4,129.54
Outline: 177.8,129.54 152.4,129.54
Outline: 152.4,129.54 152.4,104.14
Outline: 152.4,104.14 127,104.14
Outline: 127,104.14 127,129.54
Outline: 127,129.54 101.6,129.54
Outline: 101.6,129.54 101.6,104.14
Outline: 76.2,129.54 0,129.54
Copper layers (1*16): Top 0.035mm / dielectric 1.5mm / Bottom 0.035mm
Design rules "default *": minimum track width 10mil, minimum drill 24mil, track to track 12mil, track to pad 12mil, pad to pad 12mil, via to via 12mil, smd to smd 12mil, copper to edge 40mil, drill to drill 8mil, minimum pad ring 10mil, minimum via ring 8mil, stop-mask expansion 4mil, vias tented up to drill 0mil, thermal gap 10mil
Holes 2.8 mm at 78.74,50.8 78.74,30.48 175.26,30.48 175.26,50.8 175.26,25.4 175.26,2.54 73.66,25.4 73.66,2.54 2.54,25.4 114.3,25.4 114.3,2.54 2.54,30.48 2.54,86.36 73.66,86.36 2.54,2.54
Holes 2.54 mm at 78.74,2.54
Holes 2.03 mm at 73.66,30.48

### Footprints (pad centres in the part's own frame; a part is rotated, then mirrored left to right if it is on the bottom)
RB1A = drill 1.016: + -2.54,2.54 | drill 1.016 octagon: - 2.54,-2.54; AC1 2.54,2.54; AC2 -2.54,-2.54
1206 = smd 1.6 x 1.8: 1 -1.4,0; 2 1.4,0
CAP-PTH-SMALL = drill 0.7 pad 1.651: 1 0,0; 2 2.54,0
CPOL-RADIAL-100UF-25V = drill 0.7 pad 1.651 square: 1 1.27,0 | drill 0.7 pad 1.651: 2 -1.27,0
DO41-7.6 = drill 1.1 pad 1.7: A 3.81,0; C -3.81,0
SO16 = smd 0.6 x 1.2: 1 -4.445,-2.8; 2 -3.175,-2.8; 3 -1.905,-2.8; 4 -0.635,-2.8; 5 0.635,-2.8; 6 1.905,-2.8; 7 3.175,-2.8; 8 4.445,-2.8; 9 4.445,2.8; 10 3.175,2.8; 11 1.905,2.8; 12 0.635,2.8; 13 -0.635,2.8; 14 -1.905,2.8; 15 -3.175,2.8; 16 -4.445,2.8
DIL28-3 = drill 0.813 long: 1 -16.51,-3.81; 2 -13.97,-3.81; 3 -11.43,-3.81; 4 -8.89,-3.81; 5 -6.35,-3.81; 6 -3.81,-3.81; 7 -1.27,-3.81; 8 1.27,-3.81; 9 3.81,-3.81; 10 6.35,-3.81; 11 8.89,-3.81; 12 11.43,-3.81; 13 13.97,-3.81; 14 16.51,-3.81; 15 16.51,3.81; 16 13.97,3.81; 17 11.43,3.81; 18 8.89,3.81; 19 6.35,3.81; 20 3.81,3.81; 21 1.27,3.81; 22 -1.27,3.81; 23 -3.81,3.81; 24 -6.35,3.81; 25 -8.89,3.81; 26 -11.43,3.81; 27 -13.97,3.81; 28 -16.51,3.81
T05D = drill 1.016 long: 1 -3.404,-5.08; 2 -1.702,-0.914; 3 0,-5.08; 4 1.702,-0.914; 5 3.404,-5.08
TO92 = drill 0.813 octagon: 1 -1.27,0; 2 0,1.905; 3 1.27,0
1X05 = drill 1.016 pad 1.88: 1 0,0; 2 2.54,0; 3 5.08,0; 4 7.62,0; 5 10.16,0
1X05_SMALLPADS = drill 0.8 pad 1.016 long: P$1 -12.7,0; P$2 -10.16,0; P$3 -7.62,0; P$4 -5.08,0; P$5 -2.54,0
SCREWTERMINAL-3.5MM-2 = drill 1.2 pad 2.032 square: 1 0,0 | drill 1.2 pad 2.032: 2 3.5,0
1X06_SMALLPADS = drill 0.8 pad 1.016 long: P$1 -8.89,-1.27; P$2 -6.35,-1.27; P$3 -3.81,-1.27; P$4 -1.27,-1.27; P$5 1.27,-1.27; P$6 3.81,-1.27
1X02 = drill 1.016 pad 1.88: 1 0,0; 2 2.54,0
1X01 = drill 1.016 pad 1.88: 1 0,0
LBC-SE = drill 0.914 octagon: 1 -2.54,0; 2 2.54,0
BS11 = drill 0.7 long: 1 -2.5,0; 2 2.5,0
LED3MM = drill 0.813 pad 1.88: A -1.27,0; K 1.27,0
DIL06 = drill 0.813 offset: 1 -2.54,-3.81; 2 0,-3.81; 3 2.54,-3.81; 4 2.54,3.81; 5 0,3.81; 6 -2.54,3.81
SOT23 = smd 1 x 1.4: 1 -0.95,-1.1; 2 0.95,-1.1; 3 0,1.1
SOT23-3 = smd 0.8 x 0.9: 1 -0.95,-1; 2 0.95,-1; 3 0,1.1
TO92' = drill 0.813 octagon: 1 1.27,0; 2 0,1.905; 3 -1.27,0
0805 = smd 0.8 x 1.2: 1 -0.9,0; 2 0.9,0
0603-RES = smd 1.1 x 1: 1 -0.85,0; 2 0.85,0
0204V = drill 0.813 octagon: 1 -1.27,0; 2 1.27,0
TACTILE-PTH = drill 1.016 pad 1.88: 1 -3.251,2.261; 2 3.251,2.261; 3 -3.251,-2.261; 4 3.251,-2.261
SOT23-BEC = smd 1 x 1.4: B -0.95,-1.1; C 0,1.1; E 0.95,-1.1
TO220BV = drill 1.016 long: G 2.54,-2.54; T1 -2.54,-2.54; T2 0,-2.54
SO08 = smd 0.61 x 2.21: 1 -1.905,-2.616; 2 -0.635,-2.616; 3 0.635,-2.616; 4 1.905,-2.616; 5 1.905,2.616; 6 0.635,2.616; 7 -0.635,2.616; 8 -1.905,2.616
7-SEGMENT-DISPLAY = drill 0.65 pad 1.397 long: 1 -5.08,-7.62; 2 -2.54,-7.62; 3 0,-7.62; 4 2.54,-7.62; 5 5.08,-7.62; 6 5.08,7.62; 7 2.54,7.62; 8 0,7.62; 9 -2.54,7.62; 10 -5.08,7.62
7-SEGMENT-4DIGIT-TPS = drill 0.8 long: P$1 -6.35,7.62; P$2 -3.81,7.62; P$3 -1.27,7.62; P$4 1.27,7.62; P$5 3.81,7.62; P$6 6.35,7.62; P$7 6.35,-7.62; P$8 3.81,-7.62; P$9 1.27,-7.62; P$10 -1.27,-7.62; P$11 -3.81,-7.62; P$12 -6.35,-7.62
TRIM_POT = drill 1 pad 1.88: 1 5.08,0; 2 0,2.54; 3 0,-2.54
ENCODER-SW-EC12D = drill 0.8: 1 -6,4.1; 2 0,6.8; 3 6,4.1; 4 -6,-4.1; 5 6,-4.1 | hole 2.2: -6,0; 6,0
1X20 = drill 1.016 pad 1.88 square: 1 0,0 | drill 1.016 pad 1.88: 2 2.54,0; 3 5.08,0; 4 7.62,0; 5 10.16,0; 6 12.7,0; 7 15.24,0; 8 17.78,0; 9 20.32,0; 10 22.86,0; 11 25.4,0; 12 27.94,0; 13 30.48,0; 14 33.02,0; 15 35.56,0; 16 38.1,0; 17 40.64,0; 18 43.18,0; 19 45.72,0; 20 48.26,0
DIP08 = drill 0.813 pad 1.727 octagon: 1 -3.81,-3.81; 2 -1.27,-3.81; 3 1.27,-3.81; 4 3.81,-3.81; 5 3.81,3.81; 6 1.27,3.81; 7 -1.27,3.81; 8 -3.81,3.81
KK-156-5 = drill 1.7 pad 2.184 long: 1 -7.92,0; 2 -3.96,0; 3 0,0; 4 3.96,0; 5 7.92,0

### Placement (x,y rotation side)
B1  12.95,36.32 0 top
C1  97.03,48.26 270 bottom
C2  96.9,36.58 270 bottom
C3  96.27,9.65 180 bottom
C4  96.27,22.86 0 bottom
C5  17.53,71.12 0 top
C6  17.78,66.29 0 top
C7  63.5,22.61 180 bottom
C8  39.37,6.35 180 bottom
C9  21.08,32.77 90 top
C10  21.08,39.62 90 top
C11  25.91,35.81 270 bottom
C12  49.28,32.26 90 top
C13  55.12,35.31 90 top
C14  41.15,31.5 180 bottom
C15  54.1,60.96 0 bottom
C16  165.1,116.21 90 top
C17  167.64,109.22 270 top
D1  41.15,33.53 0 top
D2  165.1,113.03 180 bottom
D3  161.29,123.82 90 bottom
IC1  102.23,34.29 270 bottom
IC2  102.23,45.72 270 bottom
IC3  41.4,13.46 180 top
IC4  96.27,16.26 180 top
IC5  54.1,54.36 0 top
IC6  170.81,125.73 0 top
IC7  13.21,70.87 0 top
JP1  81.92,24.13 0 top
JP2  14.86,15.47 90 top
JP3  79.76,8.64 180 top
JP4  4.83,35.05 90 top
JP5  92.08,33.02 180 top
JP6  92.08,48.26 180 top
JP7  70.61,61.21 0 top
JP8  83.57,4.32 180 top
JP9  10.41,11.68 90 top
JP10  59.44,47.5 180 top
JP11  42.67,44.7 180 top
JP12  123.44,17.02 90 top
JP13  163.83,127.63 90 top
JP14  170.81,117.47 0 top
JP15  171.32,106.17 0 top
JP16  165.1,120.65 0 top
JP17  170.81,114.94 0 top
L1  40.13,39.12 0 top
L2  50.04,39.12 0 top
L3  157.48,122.56 90 top
L4  158.12,110.49 270 top
LED1  157.23,16.26 0 top
LED2  144.27,16.26 0 top
LED3  52.32,42.42 0 top
LED4  32.77,41.66 90 top
OK1  25.4,47.5 90 top
Q1  117.09,49.53 90 bottom
Q2  113.98,46.86 90 bottom
Q3  116.97,43.81 90 bottom
Q4  113.03,41.27 90 bottom
Q5  18.54,21.08 0 bottom
Q6  2N3906  [TO92']  13.21,75.44 0 top
R1  113.03,38.73 180 bottom
R2  109.86,37.46 180 bottom
R3  113.03,36.2 180 bottom
R4  109.86,34.92 180 bottom
R5  113.03,33.66 180 bottom
R6  109.86,32.38 180 bottom
R7  113.03,31.11 180 bottom
R8  109.86,29.84 180 bottom
R9  112.78,49.4 180 bottom
R10  109.22,45.97 180 bottom
R11  112.78,44.32 180 bottom
R12  109.22,41.4 180 bottom
R13  79.76,8.89 90 bottom
R14  22.61,20.07 0 bottom
R15  118.87,8.89 0 bottom
R16  118.87,10.92 0 bottom
R17  118.87,5.08 180 bottom
R18  118.87,7.11 180 bottom
R19  118.87,3.05 180 bottom
R20  100.33,9.65 180 bottom
R21  100.08,23.37 90 bottom
R22  102.62,23.37 90 bottom
R23  105.16,23.37 90 bottom
R24  152.4,16.26 0 bottom
R25  141.22,18.54 0 bottom
R26  14.73,15.49 180 bottom
R27  17.53,74.68 270 bottom
R28  19.05,68.07 180 bottom
R29  25.65,59.44 180 bottom
R30  21.84,59.18 180 bottom
R31  15.49,68.07 0 bottom
R32  16.76,59.69 180 bottom
R33  18.03,45.97 270 bottom
R34  29.21,41.91 270 bottom
R35  52.58,32 270 bottom
R36  52.58,35.56 90 bottom
R37  94.74,50.8 90 bottom
R38  107.95,50.16 90 bottom
R39  35.56,51.31 270 bottom
R40  48.01,53.59 90 bottom
R41  50.55,53.59 90 bottom
R42  45.47,53.59 90 bottom
R43  57.4,35.31 90 bottom
R44  32.77,46.48 270 bottom
R45  50.67,78.61 270 bottom
R46  48.13,78.61 270 bottom
R47  45.59,78.49 270 bottom
R48  43.05,78.49 270 bottom
R49  40.51,78.49 270 bottom
R50  44.2,64.39 180 bottom
R51  56.39,66.55 180 bottom
R52  62.23,47.5 180 bottom
R53  120.9,16 0 bottom
R54  173.36,108.59 270 top
R55  62.99,53.85 270 bottom
R57  175.89,110.49 270 bottom
R60  172.09,127.63 180 bottom
S1  125.73,6.35 0 top
S2  134.62,13.97 0 top
S3  134.62,6.35 0 top
S4  155.07,6.35 0 top
S5  143.51,6.35 0 top
S6  165.1,6.35 0 top
T1  174.62,116.21 0 bottom
T2  12.7,51.82 90 top
U1  31.24,34.54 270 bottom
U$1  153.67,40.64 0 top
U$2  128.27,40.64 0 top
U$3  166.37,40.64 0 top
U$4  140.97,40.64 0 top
U$5  47.12,74.3 0 top
U$6  33.78,61.09 270 top
U$7  7.62,20.57 90 top
U$8  168.45,18.9 0 top
U$9  64.52,24.89 180 top
U$10  12.7,61.98 0 top
U$11  66.04,36.83 0 top
U$12  24.64,58.17 180 top
X1  5.33,72.64 90 top

### Tracks (layer width: path | path; a pad name or v marks a point on that pad's centre or on a via)
5V  (via drill 0.9)
  Top 0.406: v58.67,14.48 v64.01,14.48 71.28,7.2 arc45 71.51,7.11 77.72,7.11 79.16,5.68 arc45 79.38,5.59 JP8.P$6 | JP6.5 83.73,50.07 arc-45 83.95,50.16 95,50.16 97.44,47.72 arc-45 97.54,47.49 IC4.7
  Bottom 0.406: 99.7,50.16 IC2.16 | IC2.10 100.58,42.55 100.97,42.16 100.97,40.26 IC1.16 | IC1.10 98.68,31.11 97.28,29.72 83.82,29.72 81.79,31.75 81.79,32.89 JP5.5 | R15.2 R16.2 117.86,11.04 117.86,9.14 116.84,7.62 95.76,7.62 95,8.38 95,9.52 C3.1 | IC3.20 IC3.21 40.13,11.94 42.67,14.48 IC3.7 42.67,15.49 43.43,14.73 58.42,14.73 v58.67,14.48 | U$9.2 61.98,22.73 C7.1 61.98,22.48 61.98,21.08 64.01,19.05 v64.01,14.48 | C8.1 37.97,9.27 IC3.20 | IC4.20 IC4.21 | C3.1 94.87,12.32 IC4.21 | 97.54,23.37 97.54,22.99 C4.1 97.67,20.2 IC4.7 97.54,18.8 95,16.26 IC4.21 | R23.2 R22.2 102.62,24.38 100.19,24.38 R21.2 98.44,24.27 97.54,23.37 | IC3.20 37.59,11.68 36.07,13.21 22.1,13.21 17.53,17.78 17.53,20.02 Q5.2 17.59,18.1 17.27,17.78 15.75,17.78 14.99,17.02 | JP1.5 92.2,24.13 93.22,25.15 96.77,25.15 97.54,24.38 97.54,23.37 | R13.1 JP8.P$6 79.76,5.47 arc45 79.85,5.24 81.41,3.68 93.59,3.68 arc45 93.82,3.78 95,4.95 95,9.39 arc45 94.9,9.61 C3.1
  Bottom 0.61: U$7.2 5.08,19.56 9.14,15.49 JP9.P$6 | JP9.P$6 R26.1 | 14.99,17.02 13.21,17.02 JP9.P$6
  Bottom 0.813: IC2.16 97.16,50.16 arc90 97.03,50.04 C1.1 94.98,49.66 R37.1 94.35,49.9 93.98,49.53 93.34,50.16 83.19,50.16 81.92,48.89 JP6.5 81.92,38.1 | JP5.5 81.92,38.1 | IC1.16 97.16,38.73 96.9,38.48 C2.1 96.78,38.1 81.92,38.1
+5V
  Top 0.406: 52.58,50.29 IC5.7
  Bottom 0.406: R32.2 18.8,58.51 18.8,53.85 19.81,52.83 27.43,52.83 28.45,53.85 U$12.8 30.65,52.16 R39.1 36.2,52.79 36.2,53.34 37.21,54.36 44.2,54.36 45.38,54.36
  Bottom 0.61: IC5.7 52.83,53.34 | 52.83,53.34 55.37,55.88 IC5.21 | IC5.21 IC5.20 | 52.83,53.34 51.73,54.44 R41.2 R40.2 R42.2 45.38,54.36 | C15.1 55.5,58.3 IC5.21 | L2.2 51.82,39.12 43.94,46.99 43.94,53.59 44.2,53.85 44.2,54.36
  Bottom 0.813: R36.2 L2.2 52.2,39.5 51.05,40.64 LED3.A
  Bottom 1.016: C13.1 52.2,39.5
AC1  (1 unrouted)
  Bottom 1.27: T2.T1 15.24,39.12 B1.AC1 13.21,41.15 7.11,41.15 4.52,38.55
AC2
  Bottom 1.27: B1.AC2 9.14,35.05 JP4.1 2.79,37.08 2.79,39.62 5.33,42.16 X1.1
AD_SW  (via drill 0.9)
  Top 0.406: IC4.23 v100.08,3.81
  Bottom 0.406: R19.1 R17.1 R18.1 117.97,5.2 117.86,5.08 101.35,5.08 v100.08,3.81 | IC4.23 100.08,11.68 101.09,10.67 101.09,9.79 R20.2
BL_D
  Bottom 0.406: Q5.3 18.54,24.64 U$9.19
BUZ1
  Bottom 0.406: IC4.28 114.3,12.45 117.86,16 R53.2
CACC0  (via drill 0.8, 0.9)
  Top 0.406: v110.49,50.8 v110.49,47.62 | v118.11,46.35 116.84,47.62 v110.49,47.62 | v110.49,47.62 110.49,43.48 v110.19,43.18
  Bottom 0.406: 111.44,42.22 Q4.2 111.69,42.47 111.35,42.47 110.64,43.18 v110.19,43.18 | Q1.2 114.62,50.48 114.3,50.8 v110.49,50.8 110.22,51.06 R38.2 107.81,51.06 106.93,51.94 94.98,51.94 R37.2 | Q3.2 117.46,46.35 v118.11,46.35 | Q2.2 112.69,47.62 v110.49,47.62
CS1
  Top 0.406: IC3.10 35.05,18.54 33.27,20.32 29.72,20.32 26.16,23.88 26.16,24.64 U$9.16
CS2
  Top 0.406: U$9.15 28.96,23.88 30.23,22.61 33.53,22.61 37.59,18.54 IC3.9
D1
  Bottom 0.406: IC5.13 68.07,51.31 71.88,55.12 71.88,65.28 66.55,70.61 43.18,70.61 40.64,68.07 40.64,66.8 U$5.P$12
D2
  Bottom 0.406: IC5.15 70.61,65.28 66.29,69.6 50.04,69.6 48.26,67.82 48.26,66.8 U$5.P$9
D3
  Bottom 0.406: IC5.16 68.07,58.42 69.6,59.94 69.6,65.02 66.04,68.58 52.07,68.58 51.05,67.56 51.05,66.8 U$5.P$8
D4
  Bottom 0.406: IC5.14 70.61,52.07 72.9,54.36 72.9,65.79 63.5,75.18 57.91,75.18 53.34,79.76 53.34,81.79 U$5.P$6
D_A
  Bottom 0.406: R50.1 43.35,66.64 U$5.P$11
D_B
  Bottom 0.406: R51.1 53.59,66.55 U$5.P$7
D_C
  Bottom 0.406: R46.1 48.13,81.53 arc-45 48.23,81.75 U$5.P$4
D_D
  Bottom 0.406: R48.1 43.05,81.53 arc-45 43.15,81.75 U$5.P$2
D_DP
  Bottom 0.406: R47.1 45.59,81.53 arc-45 45.69,81.75 U$5.P$3
D_E
  Bottom 0.406: R49.1 40.51,81.53 arc-45 40.61,81.75 U$5.P$1
D_F
  Bottom 0.406: U$5.P$10 45.85,66.05 arc45 45.94,65.82 46.99,64.77 59.94,64.77 arc-45 60.16,64.68 61.75,63.27 61.75,57.05 arc45 61.69,56.8 62.99,55.5 R55.1
D_G
  Bottom 0.406: R45.1 50.67,81.53 arc-45 50.77,81.75 U$5.P$5
DB0
  Bottom 0.406: IC3.2 55.37,18.29 49.28,24.38 U$9.7
DB1
  Bottom 0.406: IC3.3 52.83,17.78 46.74,23.88 U$9.8
DB2
  Bottom 0.406: 44.2,24.64 U$9.9 44.2,23.88 50.29,17.78 IC3.4
DB3
  Bottom 0.406: IC3.5 41.66,23.37 U$9.10
DB4
  Bottom 0.406: IC3.6 39.12,23.37 U$9.11
DB5
  Bottom 0.406: IC3.11 32.51,19.81 36.58,23.88 U$9.12
DB6
  Bottom 0.406: IC3.12 29.97,19.81 34.04,23.88 U$9.13
DB7
  Bottom 0.406: IC3.13 27.43,19.81 31.5,23.88 U$9.14
DI
  Bottom 0.406: U$9.4 56.9,22.86 58.17,21.59 59.69,21.59 62.23,19.05 62.23,8.13 60.96,6.86 60.71,6.6 54.36,6.6 52.83,8.13 IC3.26
E_A
  Bottom 0.406: U$11.3 70.83,40.93 66.55,45.21 65.79,45.21 64.52,43.94 64.52,43.69 60.45,39.62 60.2,39.62 59.69,39.62 57.66,41.66 | 57.66,41.66 57.66,41.91 | 57.66,41.91 56.9,42.67 54.1,45.47 50.8,45.47 47.75,48.51 IC5.5 | 57.66,41.91 57.66,41.66
  Bottom 0.61: IC5.5 47.75,52.49 R40.1
E_B
  Bottom 0.406: U$11.1 60.04,41.31 59.69,41.66 59.44,41.66 54.36,46.74 52.07,46.74 50.29,48.51 IC5.6
  Bottom 0.61: IC5.6 50.29,52.49 R41.1
E_SW
  Bottom 0.406: IC5.4 45.21,47.75 48.77,44.2 54.1,44.2 55.63,42.67 55.63,42.42 59.18,38.86 61.27,38.86 U$11.2
  Bottom 0.61: IC5.4 45.21,52.49 R42.1
EN
  Bottom 0.406: IC3.28 59.69,9.65 60.2,10.16 60.2,18.29 58.93,19.56 56.13,19.56 51.82,23.88 U$9.6
ENC_A
  Bottom 0.406: R22.1 IC4.5 R22.1 | U$8.1 161.83,23.62 160.27,23.62 157.23,23.62 121.16,23.62 120.65,23.62 113.54,16.51 103.12,16.51 102.62,17.02 R22.1
ENC_B
  Bottom 0.406: IC4.6 R21.1 100.08,16.26 100.84,15.49 114.05,15.49 120.9,22.35 122.17,22.35 157.23,22.35 157.48,22.35 160.27,22.35 161.04,21.59 173.05,21.59 U$8.3
ENC_SW
  Bottom 0.406: R23.1 IC4.4 105.16,18.03 105.41,17.78 113.28,17.78 120.4,24.89 120.65,24.89 160.02,24.89 167.65,24.89 U$8.2
GND  (via drill 0.6)
  Top 0.406: IC3.8 40.13,13.72 42.67,11.18 IC3.22 | IC4.8 95,17.78 97.28,15.49 97.28,12.7 IC4.22 | v72.1,32.73 75.47,32.73 arc-45 75.69,32.64 75.95,32.38 75.95,29.09 arc45 76.04,28.86 80.77,24.13 JP1.1 81.92,25.78 86.36,30.23 91.19,30.23 92.08,31.11 JP5.1 JP6.1 | U$9.20 14.7,23.33 arc-45 14.47,23.24 6.6,23.24 5.68,24.16 arc-45 5.59,24.39 5.59,26.54 9.94,30.89 arc-45 10.17,30.99 13.59,30.99 15.4,32.8 arc45 15.49,33.02 B1.-
  Bottom 0.406: R38.1 106.93,49.28 106.68,49.53 106.68,50.67 106.17,51.18 103.76,51.18 103.25,50.67 103.25,44.88 102.91,44.54 | IC3.8 40.13,14.86 | C7.2 64.52,22.99 U$9.1 64.52,21.18 65.94,19.76 65.94,9.52 61.93,5.51 42.77,5.51 42.67,5.41 | 42.67,7.87 IC3.22 42.93,9.91 | 42.67,7.87 42.67,5.41 | 42.67,5.41 42.67,4.83 40.64,2.79 14.88,2.79 JP2.P$1 14.83,2.79 JP9.P$1 11.66,2.77 10.44,2.77 3.05,10.16 2.79,10.16 2.79,21.59 4.57,23.37 6.1,23.37 7.87,21.59 7.87,19.56 8.89,18.54 11.68,18.54 16,22.86 16,24.64 U$9.20 | C8.2 41.15,6.35 42.67,7.87 | JP8.P$1 JP3.P$1 92.46,9.65 91.19,10.92 91.19,14.99 93.22,17.02 | 94.87,18.67 95,18.8 IC4.8 94.87,20.2 C4.2 94.87,18.67 | 94.87,18.67 93.22,17.02 | 93.22,17.02 79.25,17.02 78.49,17.78 78.49,23.49 79.12,24.13 JP1.1 | LED1.K 158.82,16.58 158.82,17.71 155.19,21.34 125.22,21.34 JP12.2 119.63,19.56 114.55,14.48 98.3,14.48 97.79,13.97 97.79,12.7 IC4.22 97.67,12.32 C3.2 R20.1 | LED1.K 158.5,14.22 157.99,13.72 149.61,13.72 146.81,16.51 145.8,16.51 LED2.K | LED1.K 159.95,14.8 U$8.4 U$8.5 | R31.1 16.34,67.73 C6.1 17.78,65.02 U$12.4 20.83,59.35 R30.1 | R44.1 29.38,47.33 OK1.2 28.45,47.5 27.18,46.23 27.18,40.64 28.7,39.12 31.24,39.12 31.75,38.61 33.78,38.61 35.56,40.39 36.07,40.39 36.83,41.15 39.62,41.15 39.75,41.02 | 57.66,60.96 JP7.P$1 59.18,59.94 59.18,56.39 55.37,52.58 IC5.8 55.37,48.26 56.13,47.5 JP10.2 56.9,45.97 57.66,45.21 63.5,45.21 64.52,46.23 70.1,46.23 73.66,42.67 73.66,40.13 72.39,38.86 69.6,38.86 68.83,38.1 68.83,32.73 v72.1,32.73 U$11.5 | 39.75,41.02 40.13,40.64 40.13,36.83 43.43,33.53 D1.A | X1.4 7.52,76.6 10.92,80.01 19.3,80.01 23.11,76.2 23.11,68.07 24.89,66.29 29.97,66.29 34.04,62.23 34.04,58.67 36.83,55.88
  Bottom 0.406: JP11.2 40.13,41.4 39.75,41.02 | C14.2 48.77,31.5 C12.2 | U1.4 33.86,29.9 34.04,29.72 | IC1.8 104.52,29.84 103.38,30.99 103.38,32.51 102.23,33.66 | IC2.13 101.09,46.35 102.91,44.54 | 102.91,44.54 103.02,44.42 103.02,42.24 103.99,41.27 IC2.8
  Bottom 0.61: R30.1 20.83,59.02 20.83,57.91 21.84,56.9 29.46,56.9 32.39,53.97 34.93,53.97 36.83,55.88 51.31,55.88 52.83,57.4 IC5.22 52.83,60.83 C15.2 52.7,62.35 53.34,62.99 57.15,62.99 57.91,62.23 JP7.P$1
  Bottom 0.813: 102.23,33.66 100.97,34.92 IC1.13 97.79,34.92 97.54,35.18 C2.2 96.78,35.05 95.25,35.05 93.22,33.02 JP5.1 | IC2.13 97.53,46.35 arc-90 C1.2 93.47,46.86 JP6.1 | 23.88,36.07 23.88,35.56 25.4,34.04 25.53,34.04 C11.2 25.91,32.51 28.7,29.72 34.04,29.72 48.01,29.72 C12.2 | D1.A 45.47,33.53 47.75,31.24 49.02,31.24 C12.2 | C12.2 52.41,30.99 R35.2 54.27,31.15 55.12,32 C13.2 | C13.2 56.98,34.04 R43.1 | C13.2 56.42,32.73 U$11.4 U$11.5
  Bottom 1.27: C10.2 21.59,38.35 23.88,36.07 23.88,32 23.37,31.5 C9.2 17.78,31.5 B1.-
  pour Bottom (isolate 0.406, rank 2): 2.54,25.4 73.66,25.4 73.66,2.54 2.54,2.54
  pour Bottom (isolate 0.406): 78.74,25.4 175.26,25.4 175.26,2.54 78.74,2.54
  pour Bottom (isolate 0.406): 2.54,86.36 73.66,86.36 73.66,30.48 2.54,30.48
LCD_BL  (via drill 0.9)
  Top 0.406: v21.59,17.78 21.59,12.95 IC3.15
  Bottom 0.406: R14.1 23.51,19.7 v21.59,17.78
LEDA
  Bottom 0.406: IC4.25 105.16,11.18 105.16,10.16 113.79,10.16 115.57,10.16 115.57,12.19 116.84,13.46 122.68,13.46 123.7,14.48 129.29,20.07 147.69,20.07 R24.2
LEDB
  Bottom 0.406: IC4.24 102.62,9.14 102.87,9.14 116.08,9.14 116.59,9.14 116.59,11.68 117.35,12.45 123.95,12.45 124.71,13.21 130.05,18.54 R25.2
N$1  (via drill 0.8)
  Top 0.406: v120.65,50.16 153.67,50.16 U$1.8 U$1.3
  Bottom 0.406: v120.65,50.16 120.02,49.53 120.02,48.89 119.38,48.26 118.11,48.26 116.84,46.99 116.71,46.86 Q2.3
N$2
  Top 0.406: U$2.3 U$2.8
  Bottom 0.406: Q3.3 128.27,43.81 U$2.8
N$3  (via drill 0.8)
  Top 0.406: U$4.8 v140.97,41.27 U$4.3
  Bottom 0.406: Q4.3 v140.97,41.27
N$4
  Bottom 0.406: R4.2 125.73,34.92 U$2.2 125.73,29.97 134.62,29.97 134.62,35.03 138.43,35.03 U$4.2 138.43,30.23 147.32,30.23 147.32,35.05 151.13,35.05 U$1.2 151.13,30.23 160.02,30.23 160.02,35.03 163.83,35.03 U$3.2
N$5
  Bottom 0.406: R5.2 123.19,33.66 U$2.1 123.19,29.21 135.89,29.21 | 135.89,29.21 U$4.1 | 135.89,29.21 148.59,29.21 | 148.59,29.21 U$1.1 | 148.59,29.21 161.29,29.21 U$3.1
N$6  (via drill 0.8)
  Top 0.406: v120.02,32.38 v120.02,46.99
  Bottom 0.406: R6.2 v120.02,32.38 | v120.02,46.99 120.02,46.35 125.73,46.35 U$2.9 125.73,50.55 134.62,50.55 134.62,45.97 138.43,45.97 U$4.9 138.43,51.05 147.32,51.05 147.32,46.23 151.13,46.23 U$1.9 151.13,51.05 160.02,51.05 160.02,46.23 163.83,46.23 U$3.9
N$7  (via drill 0.8)
  Top 0.406: v121.28,31.11 v121.28,48.26
  Bottom 0.406: R7.2 v121.28,31.11 | v121.28,48.26 U$2.10 123.19,51.82 135.89,51.82 | 148.59,51.82 135.89,51.82 | 135.89,51.82 U$4.10 | U$1.10 148.59,51.82 | 148.59,51.82 161.29,51.82 U$3.10
N$8  (via drill 0.8)
  Top 0.406: v120.02,29.84 133.35,29.84 U$2.5
  Bottom 0.406: R8.2 v120.02,29.84 | U$2.5 133.38,35.76 142.26,35.76 142.24,31.04 146.05,31.04 U$4.5 146.05,35.84 154.94,35.84 154.94,31.04 158.75,31.04 U$1.5 158.78,35.76 167.67,35.76 167.64,31.11 171.45,31.11 U$3.5
N$9
  Bottom 0.406: IC1.15 100.97,37.46 103.5,40 107.31,40 107.95,40 109.22,38.73 R1.1
N$10
  Bottom 0.406: R2.1 108.59,37.46 107.31,38.73 IC1.1
N$11
  Bottom 0.406: R3.1 108.38,36.2 107.11,37.46 IC1.2
N$12
  Bottom 0.406: R4.1 107.95,34.92 106.68,36.2 IC1.3
N$13
  Bottom 0.406: R5.1 107.95,33.66 106.68,34.92 IC1.4
N$14
  Bottom 0.406: IC1.5 106.68,33.66 107.95,32.38 R6.1
N$15
  Bottom 0.406: R7.1 107.95,31.11 106.68,32.38 IC1.6
N$16
  Bottom 0.406: IC1.7 106.05,31.11 107.31,29.84 R8.1
N$17  (via drill 0.8)
  Top 0.406: v118.11,51.44 166.37,51.44 U$3.8 U$3.3
  Bottom 0.406: Q1.3 118.11,49.53 v118.11,51.44
N$18
  Bottom 0.406: R3.2 129.67,36.2 130.81,35.05 | U$2.4 130.81,35.05 | 130.81,35.05 132.33,36.58 143.51,36.58 | 143.51,36.58 U$4.4 | 143.51,36.58 156.21,36.58 | 156.21,36.58 U$1.4 | 156.21,36.58 168.91,36.58 U$3.4
N$19  (via drill 0.9)
  Top 0.406: v130.56,38.1 130.56,43.43 133.35,43.43 U$2.6
  Bottom 0.406: U$2.6 133.35,45.21 142.24,45.21 142.24,50.29 146.05,50.29 U$4.6 146.05,45.21 154.94,45.21 154.94,50.29 158.75,50.29 U$1.6 158.75,45.21 167.64,45.21 167.64,50.29 171.45,50.29 U$3.6 | R2.2 129.92,37.46 v130.56,38.1
N$20
  Bottom 0.406: U$2.7 130.81,44.2 143.51,44.2 | U$4.7 143.51,44.2 | 143.51,44.2 156.21,44.2 | 156.21,44.2 U$1.7 | U$3.7 168.91,44.2 156.21,44.2 | R1.2 116.71,38.73 117.6,39.62 141.48,39.62 143.51,41.66 143.51,44.2
N$21
  Bottom 0.406: IC2.7 106.92,42.55 R12.1
N$22
  Bottom 0.406: IC2.6 108.59,43.81 109.22,44.45 111.75,44.45 R11.1
N$23
  Bottom 0.406: IC2.5 107.43,45.08 R10.1
N$24
  Bottom 0.406: IC2.4 106.05,46.35 107.31,47.62 108.59,47.62 110.36,49.4 R9.1 111.75,49.53
N$25
  Bottom 0.406: Q3.1 115.13,42.86 R11.2
N$26
  Bottom 0.406: Q2.1 110.18,45.91 R10.2
N$27
  Bottom 0.406: Q4.1 111.2,40.33 R12.2
N$28
  Bottom 0.406: Q1.1 114.5,48.58 R9.2
N$31  (1 unrouted)
  Top 0.406: 89.53,48.39 JP5.2
  Bottom 0.406: IC2.12 90.17,45.08 89.53,45.08 JP6.2 | IC1.12 99.31,33.78 98.68,33.78 98.3,33.4 96.77,33.4 94.87,31.5 90.17,31.5 89.53,32.13 JP5.2
N$32
  Bottom 0.406: IC1.14 98.81,36.2 98.43,36.58 98.17,36.58 84.45,36.58 JP5.4
N$33
  Bottom 0.406: Q5.1 21.69,20.08 R14.2
N$34
  Top 0.406: S1.3 123.72,4.09 125.98,6.35 125.98,10.85 S2.1
  Bottom 0.406: R17.2 121.49,5.08 S1.3
N$35
  Bottom 0.406: S6.1 160.1,6.86 157.48,6.86 155.73,8.61 S4.1 146.96,13.46 136.65,13.46 134.9,11.71 S2.3 130.58,10.92 R16.1
N$36
  Top 0.406: JP5.3 JP6.3
  Bottom 0.406: IC2.11 87,43.81 JP6.3 | IC1.11 99.31,32.26 98.3,32.26 96.65,30.61 87.38,30.61 87,30.99 87,31.37 JP5.3
N$37  (via drill 0.8)
  Top 0.406: v101.85,29.84 v101.6,47.62
  Bottom 0.406: IC1.9 v101.85,29.84 | v101.6,47.62 IC2.14
N$38
  Bottom 0.406: Q6.2 13.21,74.68 13.72,74.17 14.22,74.17 14.73,73.66 14.73,71.12 IC7.3 14.48,68.24 R31.2
N$39
  Bottom 0.406: IC7.1 11.94,69.85 12.7,69.09 12.7,67.56 14.22,66.04 14.22,60.96 | 14.22,60.96 U$10.3 | 14.22,60.96 15.24,61.98 U$10.1 | 14.22,60.96 14.64,60.96 R32.1
N$40
  Bottom 0.406: R15.1 122.2,8.89 S1.1 122.71,8.61 124.21,7.11 129.87,7.11 S3.1 135.41,8.61 137.16,6.86 138.51,6.86 S5.1
N$41
  Bottom 0.406: R18.2 121.16,7.11 122.43,5.84 129.62,5.84 S3.3 131.37,4.11 133.1,5.84 150.06,5.84 S4.3
N$42
  Bottom 0.406: R19.2 120.65,3.05 121.16,2.54 138.71,2.54 S5.3 140.26,4.01 141.73,2.54 160.3,2.54 S6.3
N$43
  Bottom 0.406: R46.2 48.26,77.64 48.26,75.56 45.72,73.03 40.64,73.03 38.1,70.48 38.1,65.41 38.1,65.28 41.4,61.98 45.72,61.98 47.75,59.94 IC5.24
N$44
  Bottom 0.406: LED1.A R24.1
N$45
  Bottom 0.406: IC7.2 11.94,74.04 Q6.3 11.94,73.91 11.18,73.15 10.67,72.64 10.67,69.09 11.18,68.58 11.18,66.04 U$10.2
N$46
  Bottom 0.406: R34.1 OK1.1
N$47
  Bottom 0.406: R33.2 21.42,45.12 OK1.6
N$48
  Bottom 0.406: R27.2 C5.1 17.53,68.75 R28.1
N$49
  Bottom 0.406: R28.2 19.9,66.71 C6.2 20.32,66.04 22.35,64.01 24.38,64.01 25.91,62.48 U$12.2
N$50
  Bottom 0.406: LED2.A 143,18.03 142.75,18.29 142.38,18.29 R25.1
N$51
  Bottom 0.406: R47.2 45.72,77.51 45.72,74.93 45.09,74.3 40.01,74.3 36.83,71.12 36.83,65.41 36.83,65.28 41.15,60.96 44.45,60.96 45.21,60.2 IC5.25
N$52
  Bottom 0.406: R29.2 29.59,59.44 U$6.3
N$53
  Bottom 0.813: LED3.K 53.59,40.39 54.36,39.62 55.12,39.62 57.4,37.34 R43.2
N$54
  Bottom 0.406: R30.2 22.69,61.3 U$12.3 23.37,60.87 R29.1
N$55
  Bottom 0.406: OK1.4 20.57,50.04 17.27,53.34 16.26,54.36 T2.G
N$56
  Bottom 0.406: LED4.K R44.2
N$57
  Bottom 0.813: U1.6 U1.7 U1.8 U1.1
  Bottom 1.27: B1.+ 11.43,38.86 13.72,36.58 17.78,36.58 | 17.78,36.58 17.78,39.12 19.3,40.64 20.83,40.64 C10.1 23.11,40.89 25.91,38.1 C11.1 27.86,37.21 U1.8 | 17.78,36.58 17.78,35.56 19.3,34.04 C9.1
N$58
  Bottom 0.406: U1.3 34.93,33.91 36.83,32 39.24,32 C14.1
N$59
  Bottom 0.813: L1.1 37.34,38.86 D1.C 35.69,35.18 U1.2
N$60
  Bottom 0.813: L2.1 L1.2 48.26,33.53 C12.1
N$61  (via drill 0.9)
  Top 0.406: v30.99,35.05 45.21,35.05 46.74,36.32 49.78,36.32 v50.55,35.56
  Bottom 0.406: U1.5 30.35,32.64 30.99,33.27 v30.99,35.05 | v50.55,35.56 51.56,34.54 52.41,34.54 R36.1
  Bottom 0.813: R36.1 R35.1
N$62
  Bottom 0.406: R48.2 43.18,77.51 43.18,76.2 42.55,75.56 39.37,75.56 35.56,71.75 35.56,65.41 35.56,65.28 40.64,60.2 42.16,60.2 42.67,59.69 IC5.26
N$63
  Bottom 0.406: IC5.27 40.13,59.56 34.29,65.41 34.29,72.39 39.37,77.47 40.35,77.47 R49.2
N$64
  Bottom 0.406: IC5.23 50.29,62.1 49.53,62.87 42.55,62.87 41.91,62.87 39.37,65.41 39.37,69.85 41.28,71.75 45.72,71.75 50.8,76.84 50.8,77.64 R45.2
N$65
  Bottom 0.406: IC5.11 R55.2
N$66
  Bottom 0.406: IC5.12 65.53,49.95 R52.2
N$67
  cutout Bottom: 2.54,71.12 2.54,30.48 50.8,30.48 50.8,40.64 27.94,40.64 27.94,53.34 17.78,53.34 17.78,58.42 12.7,58.42 12.7,71.12
N$68
  Bottom 0.406: JP12.1 122.82,17.02 R53.1
N$69
  Bottom 0.406: R52.1 JP10.1
N$70
  Bottom 1.016: JP13.1 D3.A
N$71
  Bottom 1.016: D3.C 157.52,120.01 L3.1
N$72
  Bottom 0.406: IC5.3 JP11.1
N$73
  Bottom 1.016: IC6.1 JP16.1 C16.1 163.19,115.57 163.19,111.76 162.56,111.12 156.21,111.12 154.94,112.4 154.94,122.51 L3.2
N$74
  Bottom 1.016: C16.2 JP17.1 | IC6.3 JP14.1 JP17.1 | D2.A JP17.1 | IC6.5 IC6.3 | IC6.3 170.81,127.5 R60.1 | C17.2 169.55,110.49 170.81,111.76 JP17.1
N$75
  Bottom 1.016: L4.1 161.25,112.99 D2.C 161.29,116.21 163.19,118.11 163.19,123.19 164.47,124.46 168.76,124.46 IC6.2
N$76
  Bottom 0.61: R54.1 173.36,114.78 T1.E
  Bottom 1.016: L4.2 167.6,107.99 C17.1 170.18,107.95 172.09,109.85 R54.1
N$77
  Bottom 0.61: IC6.4 174.27,124.82 175.89,123.19 175.89,118.11 175.26,117.47 174.8,117.47 T1.C
  Bottom 1.016: IC6.4 172.52,124.89 173.36,125.73 173.36,127.5 R60.2
N$80
  Bottom 0.61: R57.1 175.89,114.78 T1.B
N$81
  Bottom 1.016: JP15.1 172.08,106.17 arc45 172.31,106.26 R54.2 175.64,107.31 arc45 175.86,107.41 175.89,107.44 R57.2
PG_SCK
  Bottom 0.406: IC5.19 JP7.P$2 60.45,62.35 arc45 60.36,62.58 59.06,63.88 45.69,63.88 arc-45 45.46,63.97 R50.2
PG_SI
  Bottom 0.406: IC5.18 JP7.P$3 62.99,64.64 60.96,66.67 57.37,66.67 R51.2
PG_SO
  Bottom 0.406: IC5.17 JP7.P$4
PTC+
  Bottom 0.406: X1.3 7.62,72.64 9.65,74.68 9.65,77.22 10.67,78.23 11.68,78.23 12.19,78.74 14.22,78.74 14.73,78.23 14.73,75.69 Q6.1 17.44,75.44 R27.1
RESET
  Bottom 0.406: IC3.14 24.89,22.61 23.88,23.62 U$9.17
RST  (via drill 0.9)
  Top 0.406: v37.59,52.83 v66.8,52.83
  Bottom 0.406: R39.2 35.65,50.55 IC5.1 v37.59,52.83 | v66.8,52.83 66.8,59.94 JP7.P$5
RST0
  Bottom 0.406: IC4.1 112.78,22.35 109.22,25.91 108.71,26.42 80.01,26.42 77.47,23.88 77.47,17.02 79.25,15.24 80.01,15.24 81.03,14.22 81.03,10.16 80.77,9.91 | 80.77,9.91 79.87,9.91 R13.2 | JP3.P$5 82.04,8.64 80.77,9.91
RST1
  Top 0.406: IC3.1 57.91,16.76 54.1,12.95 54.1,7.11 53.59,6.6 19.05,6.6 18.03,7.62 18.03,10.41 15.52,12.93 JP2.P$5
  Bottom 0.61: JP2.P$5 14.86,13.33 15.75,14.22 15.75,15.38 R26.2
RW
  Bottom 0.406: IC3.27 55.37,9.4 57.15,7.62 60.2,7.62 60.96,8.38 61.21,8.64 61.21,18.8 59.44,20.57 57.4,20.57 54.36,23.62 U$9.5
S$18  (1 unrouted)
S$36  (1 unrouted)
SCK
  Bottom 0.406: IC4.13 82.3,20.45 84.33,22.48 85.6,22.48 86.61,23.49 86.61,23.75 JP1.3
SDO1
  Bottom 0.406: JP6.4 84.45,41.27 IC2.9
SO
  Bottom 0.406: IC4.12 84.84,20.32 86.61,22.1 88.14,22.1 89.53,23.24 JP1.4
SPI_CK0
  Bottom 0.406: JP8.P$2 JP3.P$2 IC4.19
SPI_CK1
  Bottom 0.406: 18.57,5.31 20.07,3.81 30.48,3.81 35.05,8.38 IC3.19
  Bottom 0.61: JP9.P$2 14.83,5.33 JP2.P$2 18.57,5.31
SPI_CS0
  Bottom 0.406: JP8.P$5 arc-45 82.39,5.8 83.57,6.98 83.57,11.04 arc45 83.47,11.27 IC4.16
SPI_CS1
  Bottom 0.406: IC3.16 27.43,8.38 26.67,7.62 22.86,7.62 18.8,11.68 13.46,11.68
  Bottom 0.61: JP9.P$5 12.19,12.95 13.46,11.68
SPI_SI0
  Bottom 0.406: JP8.P$3 JP3.P$3 IC4.18
SPI_SI1
  Bottom 0.406: 17.55,7.85 20.32,5.08 29.21,5.08 32.51,8.38 IC3.18
  Bottom 0.61: JP9.P$3 14.83,7.87 JP2.P$3 17.55,7.85
SPI_SO0
  Bottom 0.406: JP8.P$4 JP3.P$4 IC4.17
SPI_SO1
  Bottom 0.406: 16.76,10.41 21.08,6.1 27.69,6.1 29.97,8.38 IC3.17
  Bottom 0.61: JP9.P$4 14.83,10.41 JP2.P$4 16.74,10.39 16.76,10.41
SS1
  Bottom 0.406: IC4.14 79.76,21.72 80.39,22.35 82.68,22.35 JP1.2
T2
  Bottom 0.406: R33.1 18.03,50.29 16.51,51.82 T2.T2
  Bottom 1.27: T2.T2 12.7,51.82 9.65,54.86 9.65,68.07 9.14,68.58 5.44,68.58 X1.2
TRIAC_EN
  Bottom 0.406: R34.2 32.09,41.06 | 32.09,41.06 LED4.A | 32.09,41.06 33.44,41.06 40.13,47.75 IC5.2
TSENSE
  Top 0.406: U$6.1 33.78,58.55 U$6.2
  Bottom 0.406: C5.2 20.07,70.36 21.34,69.09 21.34,67.56 21.84,67.06 21.84,66.04 22.86,65.02 26.42,65.02 28.45,62.99 | 28.45,62.99 U$12.1 | U$12.1 28.45,62.99 | U$6.2 36.32,60.96 36.32,59.44 IC5.28 | U$12.1 28.45,62.99 | 28.45,62.99 31.5,62.99 32.77,61.72 32.77,57.02 U$6.1
VEE
  Bottom 0.406: U$7.3 10.16,22.1 14.48,26.42 19.81,26.42 U$9.18
VO
  Top 0.406: U$7.1 10.41,25.65 11.18,26.42 57.91,26.42 U$9.3

### Text on the board
_tNames: JP13 | L3 | L3 | JP16 | JP16 | IC6 | IC6 | JP14 | JP14 | JP17 | JP17 | C16 | C16 | C17 | C17 | R54 | R54 | JP15 | JP15 | L4 | L4 | Q6 | Q6 | IC7 | IC7 | C5 | C5 | C6 | C6 | X1 | X1 | U$12 | U$12 | IC5 | IC5 | JP6 | JP6 | JP6 | JP6 | JP6 | T2 | T2 | JP6 | JP6 | JP10 | JP10 | OK1 | OK1 | LED4 | LED4 | L1 | L1 | JP11 | JP11 | L2 | L2 | LED3 | LED3 | C10 | C10 | D1 | D1 | C13 | C13 | JP5 | JP5 | JP5 | JP5 | JP5 | JP4 | JP4 | B1 | B1 | C9 | C9 | C12 | C12 | JP5 | JP5 | JP1 | JP1 | U$9 | U$9 | S2 | S2 | IC4 | IC4 | LED2 | LED2 | LED1 | LED1 | JP12 | JP12 | IC3 | IC3 | S1 | S1 | S3 | S3 | S5 | S5 | S4 | S4 | S6 | S6
_bNames: R60 | R60 | D3 | D3 | T1 | T1 | D2 | D2 | R57 | R57 | R49 | R49 | R48 | R48 | R47 | R47 | R46 | R46 | R45 | R45 | R27 | R27 | R31 | R31 | R28 | R28 | R51 | R51 | R50 | R50 | C15 | C15 | R32 | R32 | R30 | R30 | R29 | R29 | R55 | R39 | R39 | R42 | R42 | R40 | R40 | R41 | R41 | IC2 | IC2 | IC2 | IC2 | IC2 | IC2 | IC2 | R37 | R37 | R37 | R37 | R37 | R37 | R37 | R38 | R38 | R38 | R38 | R38 | C1 | C1 | R38 | R38 | R9 | R9 | R9 | R9 | R9 | R9 | R9 | Q1 | Q1 | Q1 | Q1 | Q1 | Q1 | Q1 | R44 | R44 | R33 | R33 | R52 | R52 | Q2 | Q2 | Q2 | Q2 | Q2 | Q2 | Q2 | R10 | R10 | R10 | R10 | R10 | R10 | R10 | R11 | R11 | R11 | R11 | R11 | R11 | R11 | Q3 | Q3 | Q3 | Q3 | Q3 | Q3 | Q3 | R34 | R34 | R12 | R12 | R12 | R12 | R12 | R12 | R12 | Q4 | Q4 | Q4 | Q4 | Q4 | Q4 | Q4 | IC1 | IC1 | IC1 | IC1 | IC1 | IC1 | IC1 | R1 | R1 | R1 | R1 | R1 | R1 | R1 | C11 | C11 | C2 | C2 | R2 | R2 | R2 | R2 | R2 | R2 | R2 | U1 | U1 | R3 | R3 | R3 | R3 | R3 | R3 | R3 | R36 | R36 | R43 | R43 | R4 | R4 | R4 | R4 | R4 | R4 | R4 | R35 | R35 | R5 | R5 | R5 | R5 | R5 | R5 | R5 | R6 | R6 | R6 | R6 | R6 | R6 | R6 | C14 | C14 | R7 | R7 | R7 | R7 | R7 | R7 | R7 | R8 | R8 | R8 | R8 | R8 | R8 | R8 | C4 | C4 | Q5 | Q5 | R21 | R21 | R22 | R22 | R23 | R23 | C7 | C7 | R14 | R14 | R25 | R25 | R24 | R24 | R53 | R53 | R26 | R26 | R16 | R16 | R15 | R15 | R13 | R13 | C3 | C3 | R20 | R20 | R18 | R18 | C8 | C8 | R17 | R17 | R19 | R19